# EAGLE schematic BEP33_6panel_DESKTOP-T8KKGMJ_Mai-19-014544-2018_Conflict (EAGLE 7.7.0), part 1 of 2

## Sheet 1 of 7
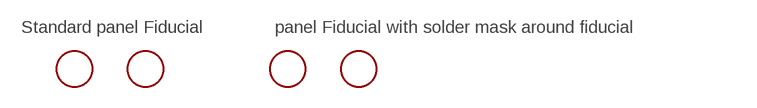
[diagram p0: schematic, sheet 1]

### Parts
FID1  FIDUCIAL  [FIDUCIAL_1MM]
FID1B  FIDUCIALFIDUCIAL_1MM_WITH_SOLDERMASK  [FIDUCIAL_1MM_WITH_SOLDERMASK]
FID2  FIDUCIAL  [FIDUCIAL_1MM]
FID2B  FIDUCIALFIDUCIAL_1MM_WITH_SOLDERMASK  [FIDUCIAL_1MM_WITH_SOLDERMASK]

### Notes on the sheet
- Standard panel Fiducial | panel Fiducial with solder mask around fiducial

## Sheet 2 of 7
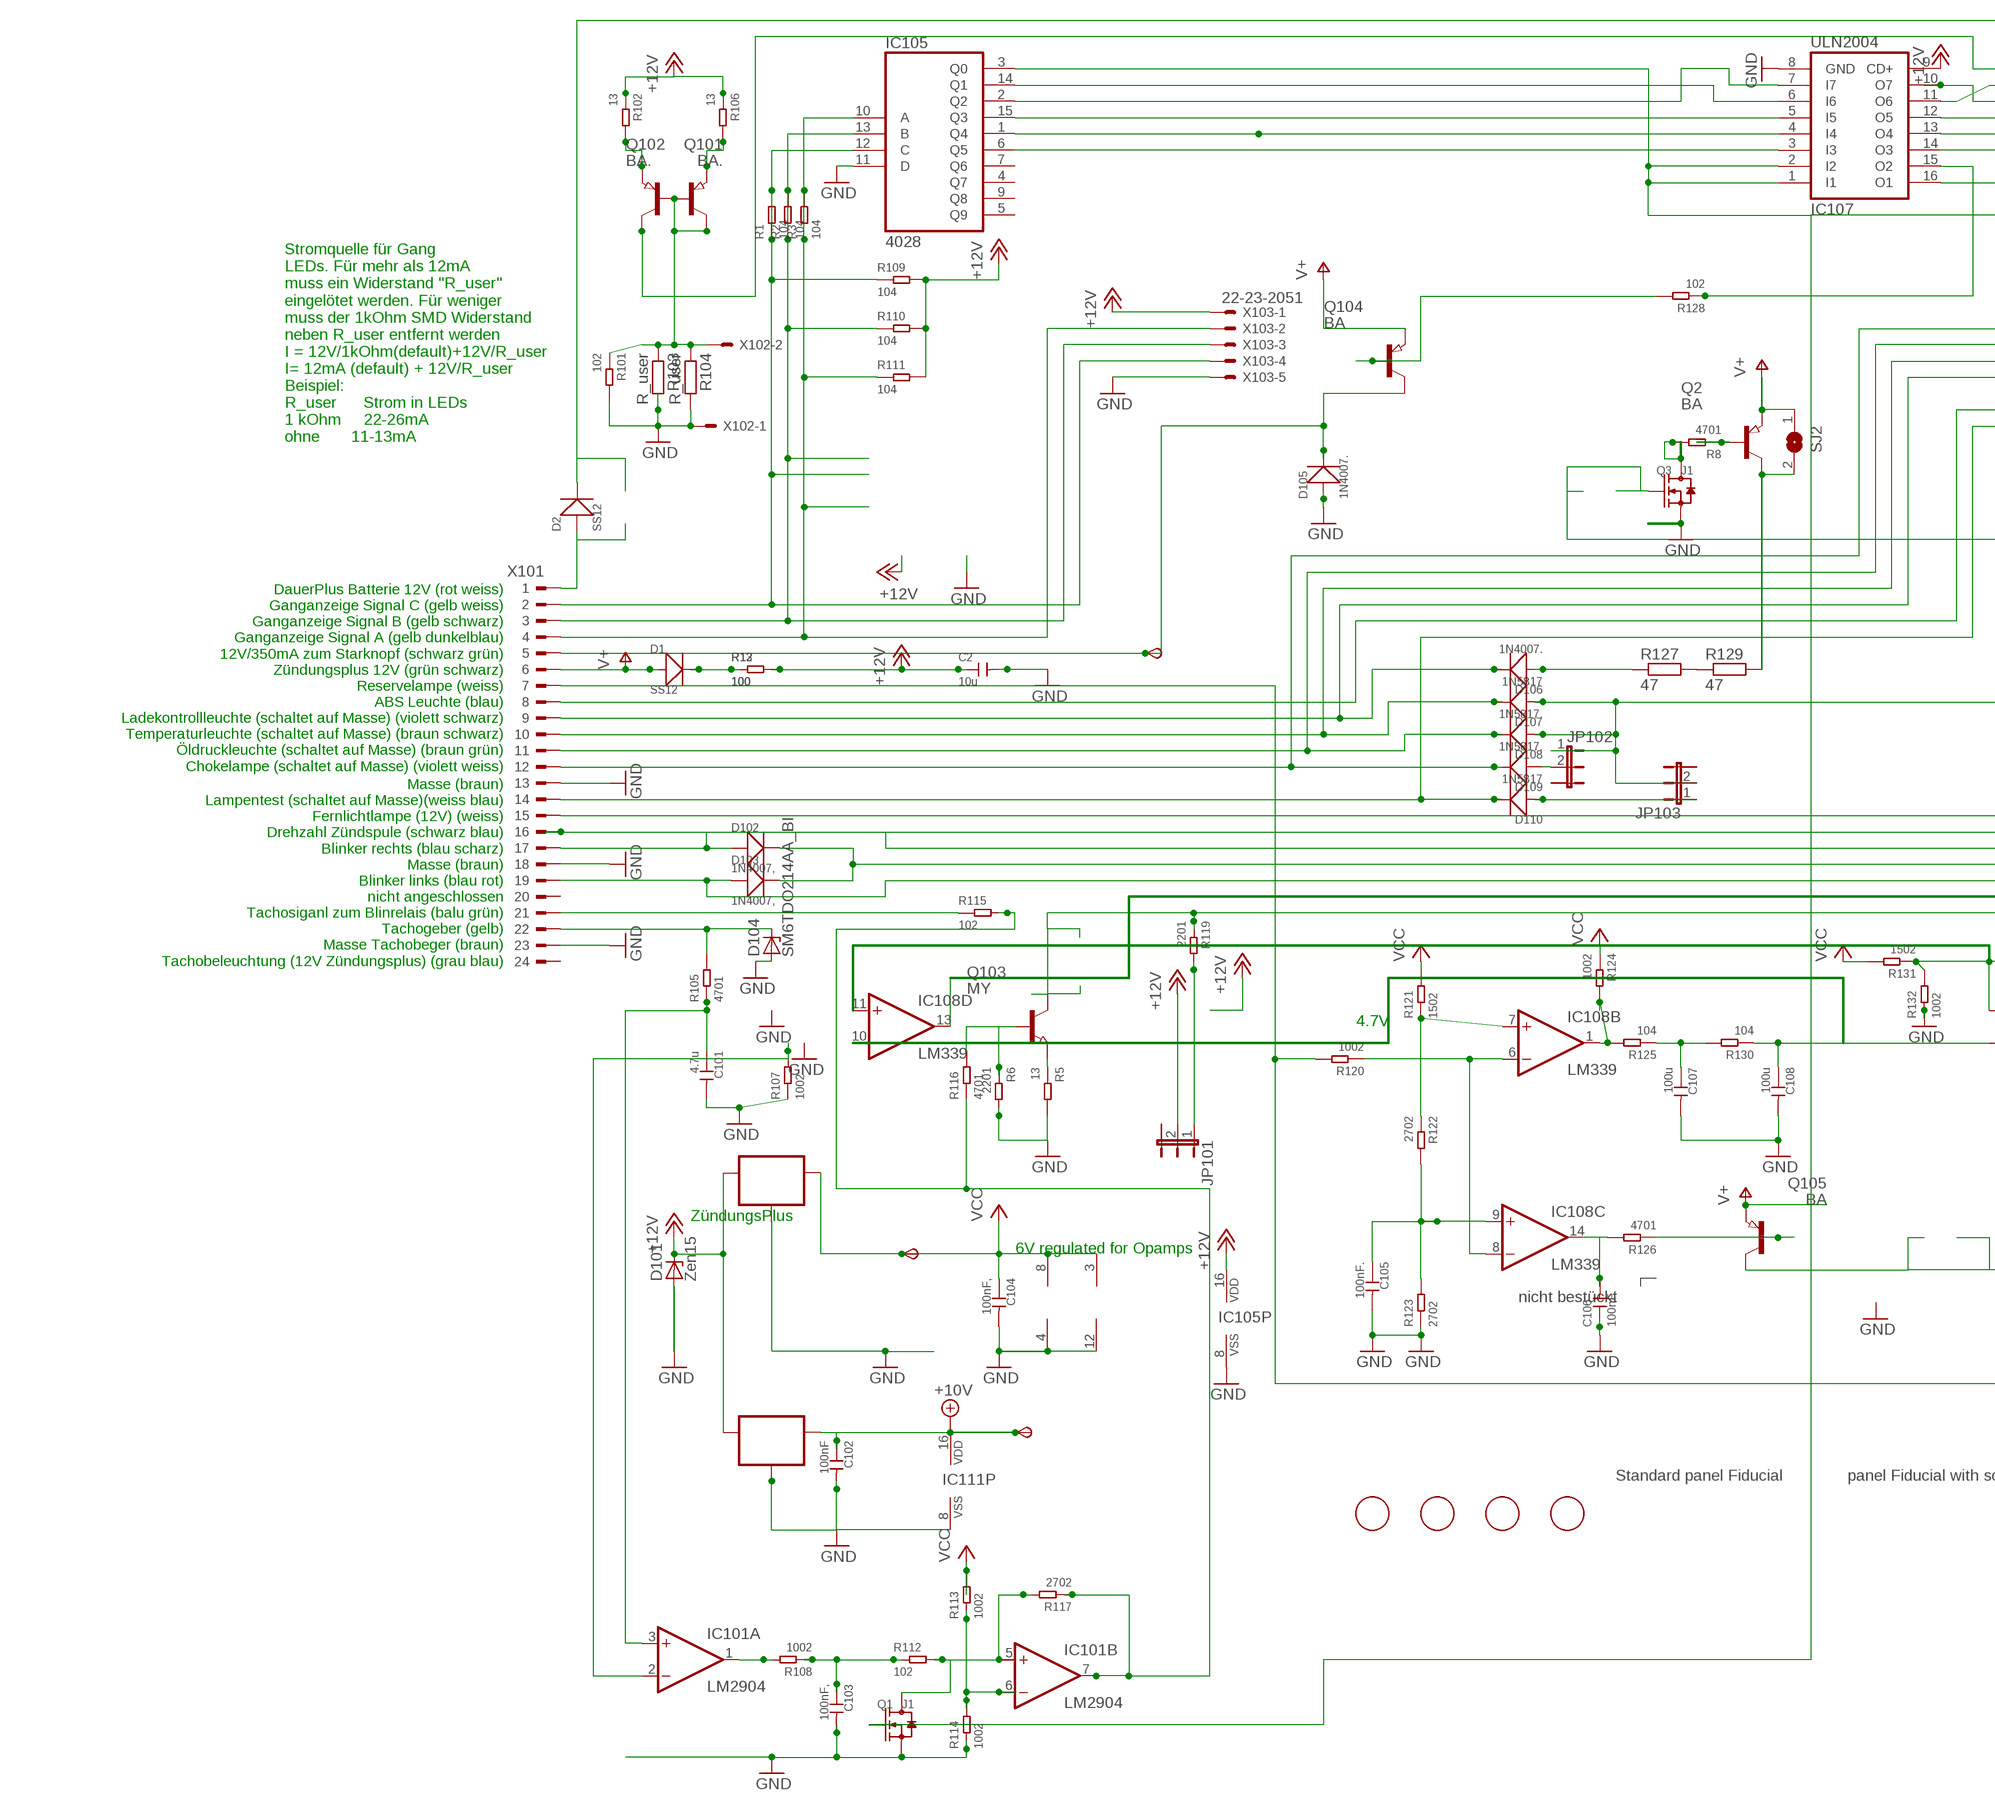
[diagram p1: schematic, sheet 2, part 1 of 2]
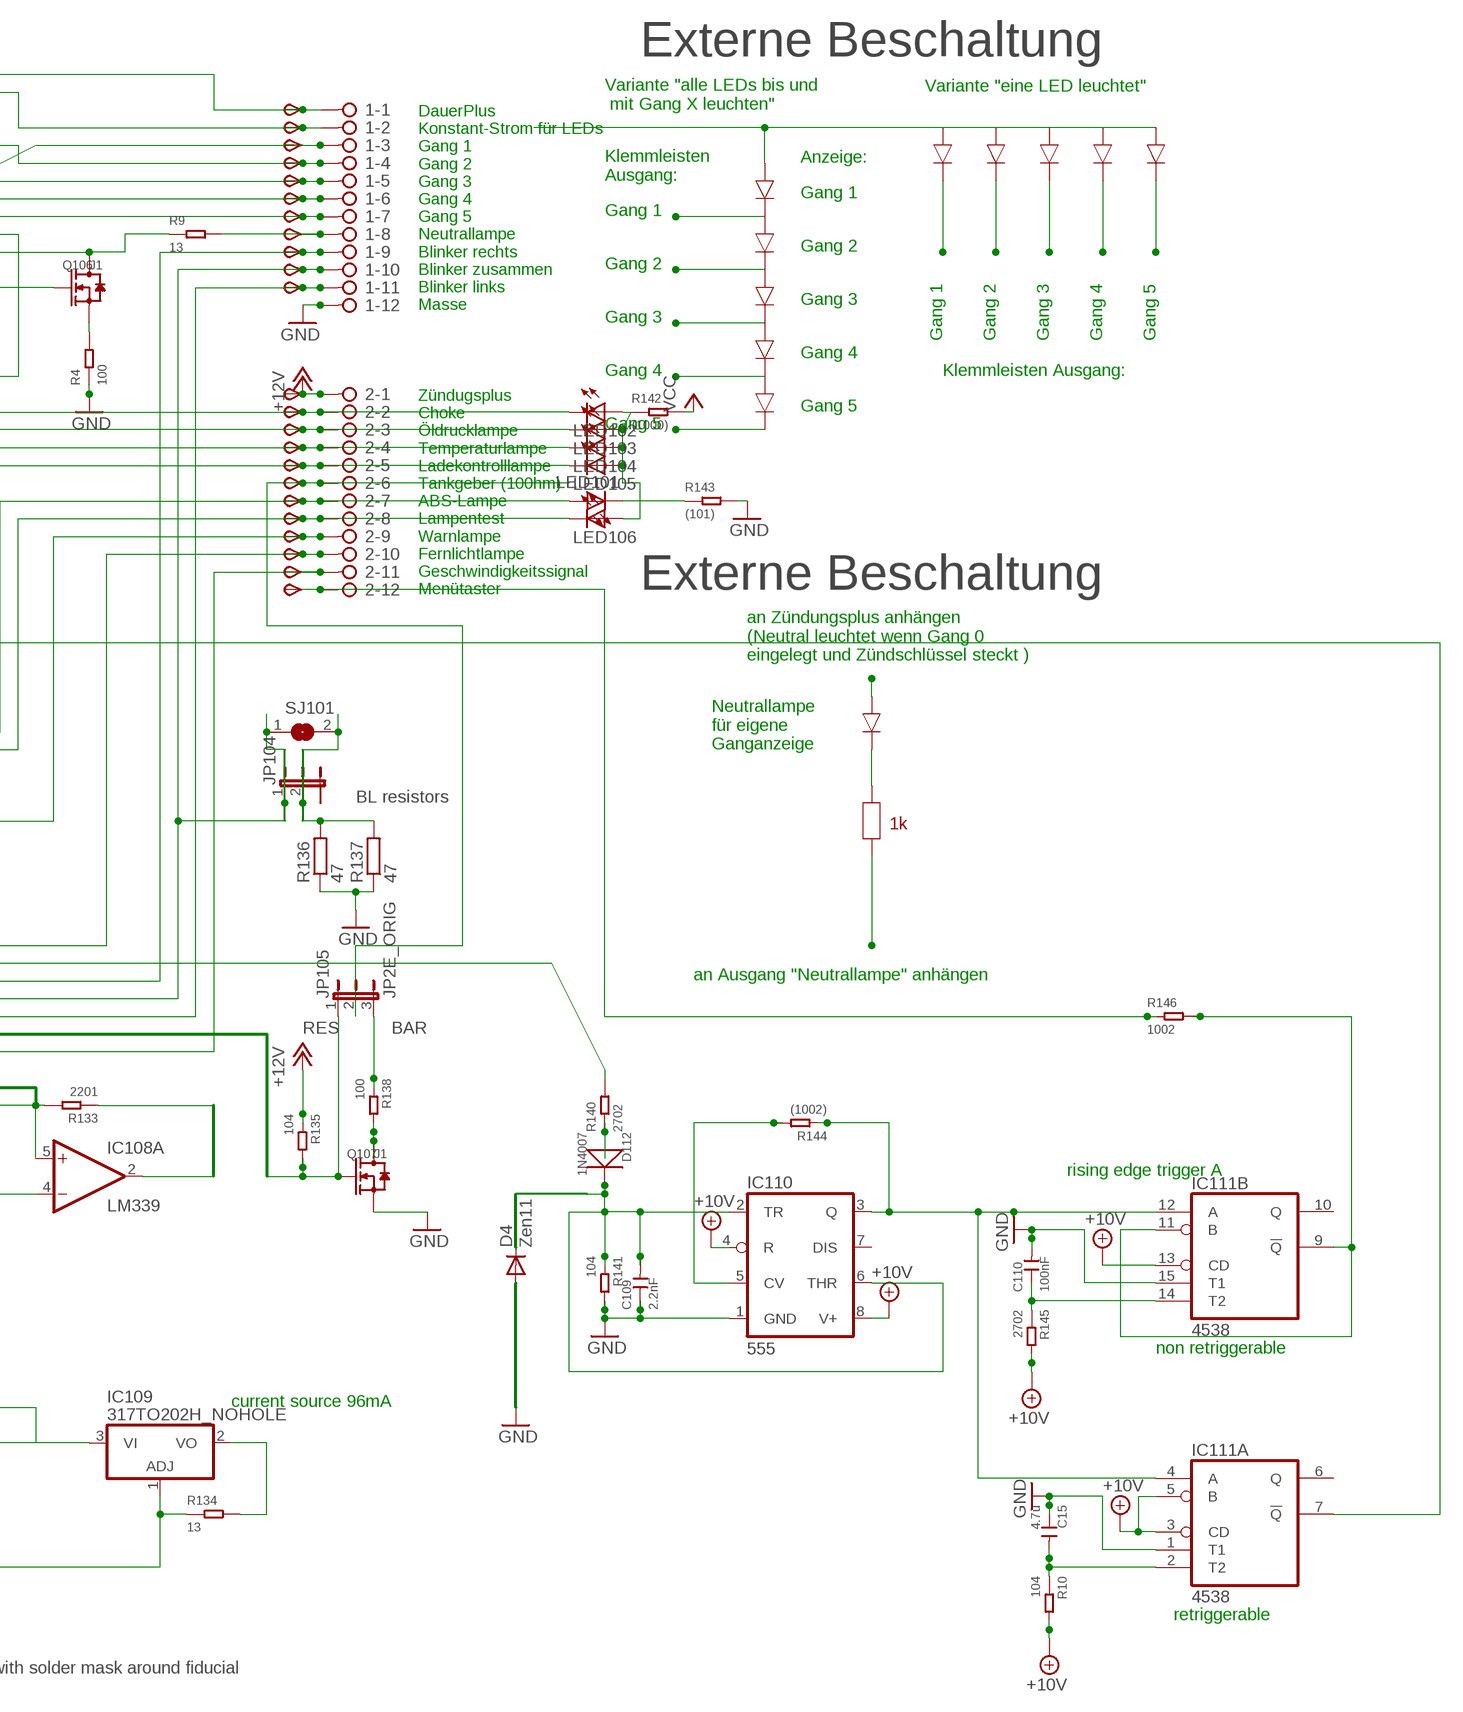
[diagram p2: schematic, sheet 2, part 2 of 2]

### Parts
1  2081-1132  [12-PIN]
2  2081-1132  [12-PIN]
6V  TPSB2.0  [B2.0]
10V  TPSB2.0  [B2.0]
C2  10u  CERAMIC-100UF-6.3V-20%-X5R(1206)  [C1206]
C15  4.7u  CERAMIC-4.7UF-25V-10%-X5R(0805)  [C0805]
C101  4.7u  CERAMIC-4.7UF-25V-10%-X5R(0805)  [C0805]
C102  100nF  CERAMIC-100NF-50V-10%-X7R(0805)  [C0805]
C103  100nF,  CERAMIC-100NF-50V-10%-X7R(0805)  [C0805]
C104  100nF,  CERAMIC-100NF-50V-10%-X7R(0805)  [C0805]
C105  100nF.  CERAMIC-100NF-50V-10%-X7R(0805)  [C0805]
C106  100nF.  CERAMIC-100NF-50V-10%-X7R(0805)  [C0805]
C107  100u  CERAMIC-100UF-6.3V-20%-X5R(1206)  [C1206]
C108  100u  CERAMIC-100UF-6.3V-20%-X5R(1206)  [C1206]
C109  2.2nF  CERAMIC-100NF-50V-10%-X7R(0805)  [C0805]
C110  100nF  CERAMIC-100NF-50V-10%-X7R(0805)  [C0805]
D1  SS12  DIODE-GEN-PURPOSE-1KV-1A(DO-214AC)DO-214AC/1206  [DO-214AC_SLIM]
D2  SS12  DIODE-GEN-PURPOSE-1KV-1A(DO-214AC)DO-214AC/1206  [DO-214AC_SLIM]
D4  Zen11  CGRM4001-G  [SOD-123_MINI-SMA]
D101  Zen15  SM6T  [DO214AA]
D102  1N4007,  DIODE-GEN-PURPOSE-1KV-1A(DO-214AC)  [DO-214AC]
D103  1N4007,  DIODE-GEN-PURPOSE-1KV-1A(DO-214AC)  [DO-214AC]
D104  SM6TDO214AA_BI  [DO214AA_BI]
D105  1N4007.  DIODE-GEN-PURPOSE-1KV-1A(DO-214AC)  [DO-214AC]
D106  1N4007.  DIODE-GEN-PURPOSE-1KV-1A(DO-214AC)  [DO-214AC]
D107  1N5817  DIODE-GEN-PURPOSE-1KV-1A(DO-214AC)DO-214AC/1206  [DO-214AC_SLIM]
D108  1N5817.  DIODE-GEN-PURPOSE-1KV-1A(DO-214AC)DO-214AC/1206  [DO-214AC_SLIM]
D109  1N5817.  DIODE-GEN-PURPOSE-1KV-1A(DO-214AC)DO-214AC/1206  [DO-214AC_SLIM]
D110  1N5817  DIODE-GEN-PURPOSE-1KV-1A(DO-214AC)DO-214AC/1206  [DO-214AC_SLIM]
D112  1N4007  DIODE-GEN-PURPOSE-1KV-1A(DO-214AC)  [DO-214AC]
FID101  FIDUCIAL  [FIDUCIAL_1MM]
FID102  FIDUCIAL  [FIDUCIAL_1MM]
FID103  FIDUCIAL  [FIDUCIAL_1MM]
FID104  FIDUCIAL  [FIDUCIAL_1MM]
IC101  LM2904  LM358D  [SO08]
IC102  78L06  78LXXSOT89_ROUND  [SOT89_ROUND]
IC104  78L10  78LXXSOT89_ROUND  [SOT89_ROUND]
IC105  4028  4028D  [SO16]
IC107  ULN2004  ULN2004AD  [SO16]
IC108  LM339  LM339D  [SO14]
IC109  317TO202H_NOHOLE  [TO220H_NOHOLE]
IC110  555  NE555D  [SO08]
IC111  4538  4538D  [SO16]
JP101  JP2EJP2_SMALLPADS  [JP2_SMALLPADS]
JP102  JP2EJP2_SMALLPADS  [JP2_SMALLPADS]
JP103  JP2EJP2_SMALLPADS  [JP2_SMALLPADS]
JP104  JP2EJP2_SMALLPADS  [JP2_SMALLPADS]
JP105  JP2E_ORIG  [JP2_ORIG_SMALLPADS]
LED101  LEDLD260  [LD260]
LED102  LEDLD260  [LD260]
LED103  LEDLD260  [LD260]
LED104  LEDLD260  [LD260]
LED105  LEDLD260  [LD260]
LED106  LEDLD260  [LD260]
Q1  J1  SMD-MOSFET-N-CH-50V-200MA-BSS138W-7-F(SOT-23)  [SOT-23]
Q2  BA  PNP-TRANSISTOR_SOT89  [SOT89]
Q3  J1  SMD-MOSFET-N-CH-50V-200MA-BSS138W-7-F(SOT-23)  [SOT-23]
Q101  BA.  PNP-TRANSISTOR_SOT89  [SOT89]
Q102  BA.  PNP-TRANSISTOR_SOT89  [SOT89]
Q103  MY  NPN-TRANSISTOR_SOT89  [SOT89]
Q104  BA  PNP-TRANSISTOR_SOT89  [SOT89]
Q105  BA  PNP-TRANSISTOR_SOT89  [SOT89]
Q106  J1  SMD-MOSFET-N-CH-50V-200MA-BSS138W-7-F(SOT-23)  [SOT-23]
Q107  J1  SMD-MOSFET-N-CH-50V-200MA-BSS138W-7-F(SOT-23)  [SOT-23]
R1  104  SMD-RES-10K-1%-1/8W(0805)  [R0805]
R2  104  SMD-RES-10K-1%-1/8W(0805)  [R0805]
R3  104  SMD-RES-10K-1%-1/8W(0805)  [R0805]
R4  100  SMD-RES-220R-5%-1/8W(0805)  [R0805]
R5  13  SMD-RES-13R-5%-1/4W(1206)  [R1206]
R6  2201  SMD-RES-1K-5%-1/8W(0805)  [R0805]
R8  4701  SMD-RES-4.7K-5%-1/8W(0805)  [R0805]
R9  13  SMD-RES-13R-5%-1/4W(1206)  [R1206]
R10  104  SMD-RES-4.7K-5%-1/8W(0805)  [R0805]
R12  100  SMD-RES-2.2K-5%-1/8W(0805)  [R0805]
R13  100  SMD-RES-2.2K-5%-1/8W(0805)  [R0805]
R101  102  SMD-RES-1K-5%-1/8W(0805)  [R0805]
R102  13  SMD-RES-13R-5%-1/4W(1206)  [R1206]
R103  R_user  R-EU_R0805  [R0805]
R104  R_user  R-EU_R0805  [R0805]
R105  4701  SMD-RES-4.7K-5%-1/8W(0805)  [R0805]
R106  13  SMD-RES-13R-5%-1/4W(1206)  [R1206]
R107  1002  SMD-RES-10K-1%-1/8W(0805)  [R0805]
R108  1002  SMD-RES-10K-1%-1/8W(0805)  [R0805]
R109  104  SMD-RES-10K-1%-1/8W(0805)  [R0805]
R110  104  SMD-RES-10K-1%-1/8W(0805)  [R0805]
R111  104  SMD-RES-10K-1%-1/8W(0805)  [R0805]
R112  102  SMD-RES-1K-5%-1/8W(0805)  [R0805]
R113  1002  SMD-RES-1K-5%-1/8W(0805)  [R0805]
R114  1002  SMD-RES-1K-5%-1/8W(0805)  [R0805]
R115  102  SMD-RES-220R-5%-1/8W(0805)  [R0805]
R116  4701  SMD-RES-4.7K-5%-1/8W(0805)  [R0805]
R117  2702  SMD-RES-4.7K-5%-1/8W(0805)  [R0805]
R119  2201  SMD-RES-2.2K-5%-1/8W(0805)  [R0805]
R120  1002  SMD-RES-10K-1%-1/8W(0805)  [R0805]
R121  1502  SMD-RES-10K-1%-1/8W(0805)  [R0805]
R122  2702  SMD-RES-4.7K-5%-1/8W(0805)  [R0805]
R123  2702  SMD-RES-4.7K-5%-1/8W(0805)  [R0805]
R124  1002  SMD-RES-10K-1%-1/8W(0805)  [R0805]
R125  104  SMD-RES-10K-1%-1/8W(0805)  [R0805]
R126  4701  SMD-RES-4.7K-5%-1/8W(0805)  [R0805]
R127  47  R-EU_V235/17_1MM  [V235/17_1MM]
R128  102  SMD-RES-1K-5%-1/8W(0805)  [R0805]
R129  47  R-EU_V235/17_1MM  [V235/17_1MM]
R130  104  SMD-RES-10K-1%-1/8W(0805)  [R0805]
R131  1502  SMD-RES-10K-1%-1/8W(0805)  [R0805]
R132  1002  SMD-RES-10K-1%-1/8W(0805)  [R0805]
R133  2201  SMD-RES-2.2K-5%-1/8W(0805)  [R0805]
R134  13  SMD-RES-13R-5%-1/4W(1206)  [R1206]
R135  104  SMD-RES-10K-1%-1/8W(0805)  [R0805]
R136  47  R-EU_V235/17_1MM  [V235/17_1MM]
R137  47  R-EU_V235/17_1MM  [V235/17_1MM]
R138  100  SMD-RES-2.2K-5%-1/8W(0805)  [R0805]
R140  2702  SMD-RES-10K-1%-1/8W(0805)  [R0805]
R141  104  SMD-RES-10K-1%-1/8W(0805)  [R0805]
R142  (1000)  SMD-RES-100R-5%-1/8W(0805)  [R0805]
R143  (101)  SMD-RES-100R-5%-1/8W(0805)  [R0805]
R144  (1002)  SMD-RES-10K-1%-1/8W(0805)  [R0805]
R145  2702  SMD-RES-4.7K-5%-1/8W(0805)  [R0805]
R146  1002  SMD-RES-4.7K-5%-1/8W(0805)  [R0805]
SJ2  SJ  [SJ]
SJ101  SJ  [SJ]
START  TPSB2.0  [B2.0]
TP1  TPSB2.0  [B2.0]
TP2  TPSB2.0  [B2.0]
TP3  TPSB2.0  [B2.0]
TP4  TPSB2.0  [B2.0]
TP5  TPSB2.0  [B2.0]
TP6  TPSB2.0  [B2.0]
TP7  TPSB2.0  [B2.0]
TP8  TPSB2.0  [B2.0]
TP9  TPSB2.0  [B2.0]
TP10  TPSB2.0  [B2.0]
TP11  TPSB2.0  [B2.0]
TP12  TPSB2.0  [B2.0]
TP13  TPSB2.0  [B2.0]
TP16  TPSB2.0  [B2.0]
TP17  TPSB2.0  [B2.0]
TP18  TPSB2.0  [B2.0]
TP19  TPSB2.0  [B2.0]
TP21  TPSB2.0  [B2.0]
TP22  TPSB2.0  [B2.0]
TP23  TPSB2.0  [B2.0]
TP24  TPSB1,27  [B1,27]
TP25  TPSB2.0  [B2.0]
TP26  TPSB2.0  [B2.0]
X101  CON_BMWV2  [24-PIN_V2]
X102  22-23-2021  [22-23-2021]
X103  22-23-2051  [22-23-2051]

### Nets
+10V: 10V.TP(PP) C102.1 IC104.1(OUT) IC110.4(R) IC110.8(V+) IC111.3(A:CD) IC111.5(A:B) IC111.13(B:CD) IC111.16(P:VDD) R10.2 R145.2 ; also sheet 3,4,5,6,7
+12V: 2.1 C2.1 D101.C IC102.3(IN) IC104.3(IN) IC105.16(VDD) IC107.9(CD+) JP101.2 R12.2 R13.2 R102.1 R106.1 R109.2 R110.2 R111.2 R135.1 TP12.TP(PP) X103.1 ; also sheet 3,4,5,6,7
+12V1: 2.11 Q103.2(C) R119.1 TP26.TP(PP)
GND: 1.12 C2.2 C15.1 C101.2 C102.2 C103.2 C104.2 C105.2 C106.1 C107.2 C108.2 C109.1 C110.2 D4.A D101.A D104.A D105.1(+) IC101.4(P:V-) IC102.2(GND) IC102.2@1(GND) IC104.2(GND) IC104.2@1(GND) IC105.8(VSS) IC105.11(D) IC107.8(GND) IC108.12(P:GND) IC110.1(GND) IC111.1(A:T1) IC111.8(P:VSS) IC111.15(B:T1) Q1.2(S) Q3.2(S) Q107.2(S) R4.1 R5.2 R6.2 R101.2 R103.2 R104.2 R107.1 R114.1 R123.1 R132.1 R136.1 R137.1 R141.2 R143.2 X101.13 X101.18 X101.23 X102.1 X103.5 ; also sheet 3,4,5,6,7
N$1: 2.9 D107.1(+) D108.1(+) JP102.1 JP103.2 TP24.TP(PP)
N$2: IC105.10(A) R3.1 R3.2 R111.1 X101.4 X103.2
N$3: IC105.13(B) R2.1 R2.2 R110.1 X101.3 X103.3
N$4: 2.7 LED101.A TP22.TP(PP) X101.8
N$5: Q101.3(E) R102.2
N$6: Q2.1(B) R8.1
N$7: IC101.2(A:-IN) R107.2
N$8: R127.2 R129.1
N$9: Q102.3(E) R106.2
N$11: D105.2(-) Q104.2(C) START.TP(PP) X101.5
N$12: 2.2 D109.2(-) LED102.K(C) TP16.TP(PP) X101.12
N$13: 2.3 D108.2(-) LED103.K(C) TP17.TP(PP) X101.11
N$14: 2.4 D107.2(-) LED104.K(C) TP18.TP(PP) X101.10
N$15: IC109.3(VI) Q105.2(C)
N$16: IC108.6(B:-IN) IC108.8(C:-IN) R120.1
N$17: IC105.12(C) R1.1 R1.2 R109.1 X101.2 X103.4
N$18: IC105.15(Q3) IC107.5(I5)
N$19: 2.8 D110.2(-) LED106.K(C) TP23.TP(PP) X101.14
N$20: 1.9 D102.1(+) TP9.TP(PP) X101.17
N$21: 1.11 D103.1(+) TP11.TP(PP) X101.19
N$22: IC111.9(B:!Q) IC111.11(B:B) R146.2
N$23: D104.C R105.2 X101.22
N$24: C101.1 IC101.3(A:+IN) R105.1
N$25: 1.6 IC107.13(O4) TP6.TP(PP)
N$26: 1.7 IC107.14(O3) TP7.TP(PP)
N$27: D1.2(-) R12.1 R13.1
N$28: 2.6 JP105.2 TP21.TP(PP)
N$29: JP101.1 R119.2
N$30: C105.1 IC108.9(C:+IN) R122.2 R123.2
N$31: C106.2 IC108.14(C:OUT) R126.2
N$32: Q3.3(D) R8.2
N$34: LED101.K(C) R143.1
N$35: IC109.1(ADJ) R120.2 R134.1 X101.7
N$36: Q105.1(B) R126.1
N$37: IC105.2(Q2) IC107.7(I7)
N$38: 1.3 IC107.11(O6) TP3.TP(PP)
N$39: 1.5 IC107.12(O5) TP5.TP(PP)
N$41: LED102.A LED103.A LED104.A LED105.A LED106.A R142.1
N$42: R140.2 X101.16
N$43: Q104.1(B) R128.2
N$44: IC105.3(Q0) IC107.1(I1) IC107.2(I2) Q1.1(G) Q106.1(G)
N$45: C107.1 R125.1 R130.2
N$46: C108.1 IC108.4(A:-IN) IC108.10(D:-IN) R130.1
N$47: IC108.5(A:+IN) IC108.11(D:+IN) R131.1 R132.2 R133.2
N$48: Q107.3(D) R138.2
N$49: IC111.7(A:!Q) Q3.1(G)
N$50: IC105.1(Q4) IC107.4(I4)
N$51: R115.1 X101.21
N$52: IC107.16(O1) Q106.3(D) R9.1
N$53: 2.10 TP25.TP(PP) X101.15
N$54: D106.1(+) R127.1
N$55: 2.5 D106.2(-) LED105.K(C) TP19.TP(PP) X101.9
N$56: IC105.14(Q1) IC107.6(I6)
N$57: Q101.1(B) Q102.1(B) Q102.2(C) R101.1 R103.1 R104.1 X102.2
N$58: 1.8 R9.2 TP8.TP(PP)
N$59: 1.2 Q101.2(C) TP2.TP(PP)
N$60: IC108.13(D:OUT) JP105.1 Q107.1(G) R135.2
N$61: IC105.6(Q5) IC107.3(I3)
N$64: IC109.2(VO) R134.2
N$65: IC110.5(CV) R144.2
N$67: 1.4 IC107.10(O7) TP4.TP(PP)
N$69: 1.1 D2.2(-) TP1.TP(PP)
N$83: IC108.7(B:+IN) R121.1 R122.1
N$84: Q106.2(S) R4.2
N$85: Q103.1(B) R6.1 R116.2
N$86: IC110.3(Q) IC111.4(A:A) IC111.12(B:A) R144.1
N$87: D112.1(+) R140.1
N$88: IC107.15(O2) R128.1
N$89: C110.1 IC111.14(B:T2) R145.1
N$90: 2.12 R146.1 TP13.TP(PP)
N$91: D2.1(+) X101.1
N$92: IC101.1(A:OUT) R108.2
N$93: 1.10 D102.2(-) D103.2(-) JP104.1 SJ101.1 TP10.TP(PP)
N$94: JP104.2 R136.2 R137.2 SJ101.2
N$95: D109.1(+) JP102.2
N$96: C103.1 R108.1 R112.1
N$97: IC101.5(B:+IN) Q1.3(D) R112.2 R117.2
N$98: D110.1(+) JP103.1
N$99: JP105.3 R138.1
N$100: Q103.3(E) R5.1
N$101: IC101.6(B:-IN) R113.1 R114.2
N$102: C109.2 D4.C D112.2(-) IC110.2(TR) IC110.6(THR) R141.1
N$103: C15.2 IC111.2(A:T2) R10.1
N$104: Q2.2(C) R129.2 SJ2.2
N$107: IC101.7(B:OUT) R115.2 R116.1 R117.1
N$108: IC108.2(A:OUT) R133.1
N$580: IC108.1(B:OUT) R124.2 R125.2
V+: D1.1(+) Q2.3(E) Q104.3(E) Q105.3(E) SJ2.1 X101.6 ; also sheet 3,4,5,6,7
VCC: 6V.TP(PP) C104.1 IC101.8(P:V+) IC102.1(OUT) IC108.3(P:V+) R113.2 R121.2 R124.1 R131.2 R142.2 ; also sheet 3,4,5,6,7
Unconnected: IC105.4(Q7) IC105.5(Q9) IC105.7(Q6) IC105.9(Q8) IC110.7(DIS) IC111.6(A:Q) IC111.10(B:Q) X101.20 X101.24

### Notes on the sheet
- Externe Beschaltung
- Variante "eine LED leuchtet"
- Variante "alle LEDs bis und
   mit Gang X leuchten"
- Anzeige:
- Klemmleisten
  Ausgang:
- Gang 1
- DauerPlus
  Konstant-Strom für LEDs
  Gang 1
  Gang 2
  Gang 3
  Gang 4
  Gang 5
  Neutrallampe
  Blinker rechts
  Blinker zusammen
  Blinker links
  Masse
- Gang 1
- Gang 2
- Gang 2
- Gang 3
- Gang 3
- Gang 1 | Gang 2 | Gang 3 | Gang 4 | Gang 5
- Gang 4
- Gang 4 | Klemmleisten Ausgang:
- Gang 5
- Gang 5
- Zündugsplus
  Choke
  Öldrucklampe
  Temperaturlampe
  Ladekontrolllampe
  Tankgeber (100hm)
  ABS-Lampe
  Lampentest
  Warnlampe
  Fernlichtlampe
  Geschwindigkeitssignal
  Menütaster
- Stromquelle für Gang
  LEDs. Für mehr als 12mA
  muss ein Widerstand "R_user"
  eingelötet werden. Für weniger
  muss der 1kOhm SMD Widerstand
  neben R_user entfernt werden
  I = 12V/1kOhm(default)+12V/R_user
  I= 12mA (default) + 12V/R_user
  Beispiel:
  R_user      Strom in LEDs
  1 kOhm     22-26mA
  ohne       11-13mA
- Externe Beschaltung
- an Zündungsplus anhängen
  (Neutral leuchtet wenn Gang 0
  eingelegt und Zündschlüssel steckt )
- Neutrallampe
  für eigene
  Ganganzeige
- DauerPlus Batterie 12V (rot weiss)
  Ganganzeige Signal C (gelb weiss)
  Ganganzeige Signal B (gelb schwarz)
  Ganganzeige Signal A (gelb dunkelblau)
  12V/350mA zum Starknopf (schwarz grün)
  Zündungsplus 12V (grün schwarz)
  Reservelampe (weiss)
  ABS Leuchte (blau)
  Ladekontrollleuchte (schaltet auf Masse) (violett schwarz)
  Temperaturleuchte (schaltet auf Masse) (braun schwarz)
  Öldruckleuchte (schaltet auf Masse) (braun grün)
  Chokelampe (schaltet auf Masse) (violett weiss)
- BL resistors
- 1k
- an Ausgang "Neutrallampe" anhängen
- Masse (braun)
  Lampentest (schaltet auf Masse)(weiss blau)
  Fernlichtlampe (12V) (weiss)
  Drehzahl Zündspule (schwarz blau)
  Blinker rechts (blau scharz)
  Masse (braun)
  Blinker links (blau rot)
  nicht angeschlossen
  Tachosiganl zum Blinrelais (balu grün)
  Tachogeber (gelb)
  Masse Tachobeger (braun)
  Tachobeleuchtung (12V Zündungsplus) (grau blau)
- RES | BAR
- 4.7V | rising edge trigger A
- non retriggerable
- ZündungsPlus
- current source 96mA
- 6V regulated for Opamps
- nicht bestückt
- retriggerable
- Standard panel Fiducial | panel Fiducial with solder mask around fiducial

## Sheet 3 of 7
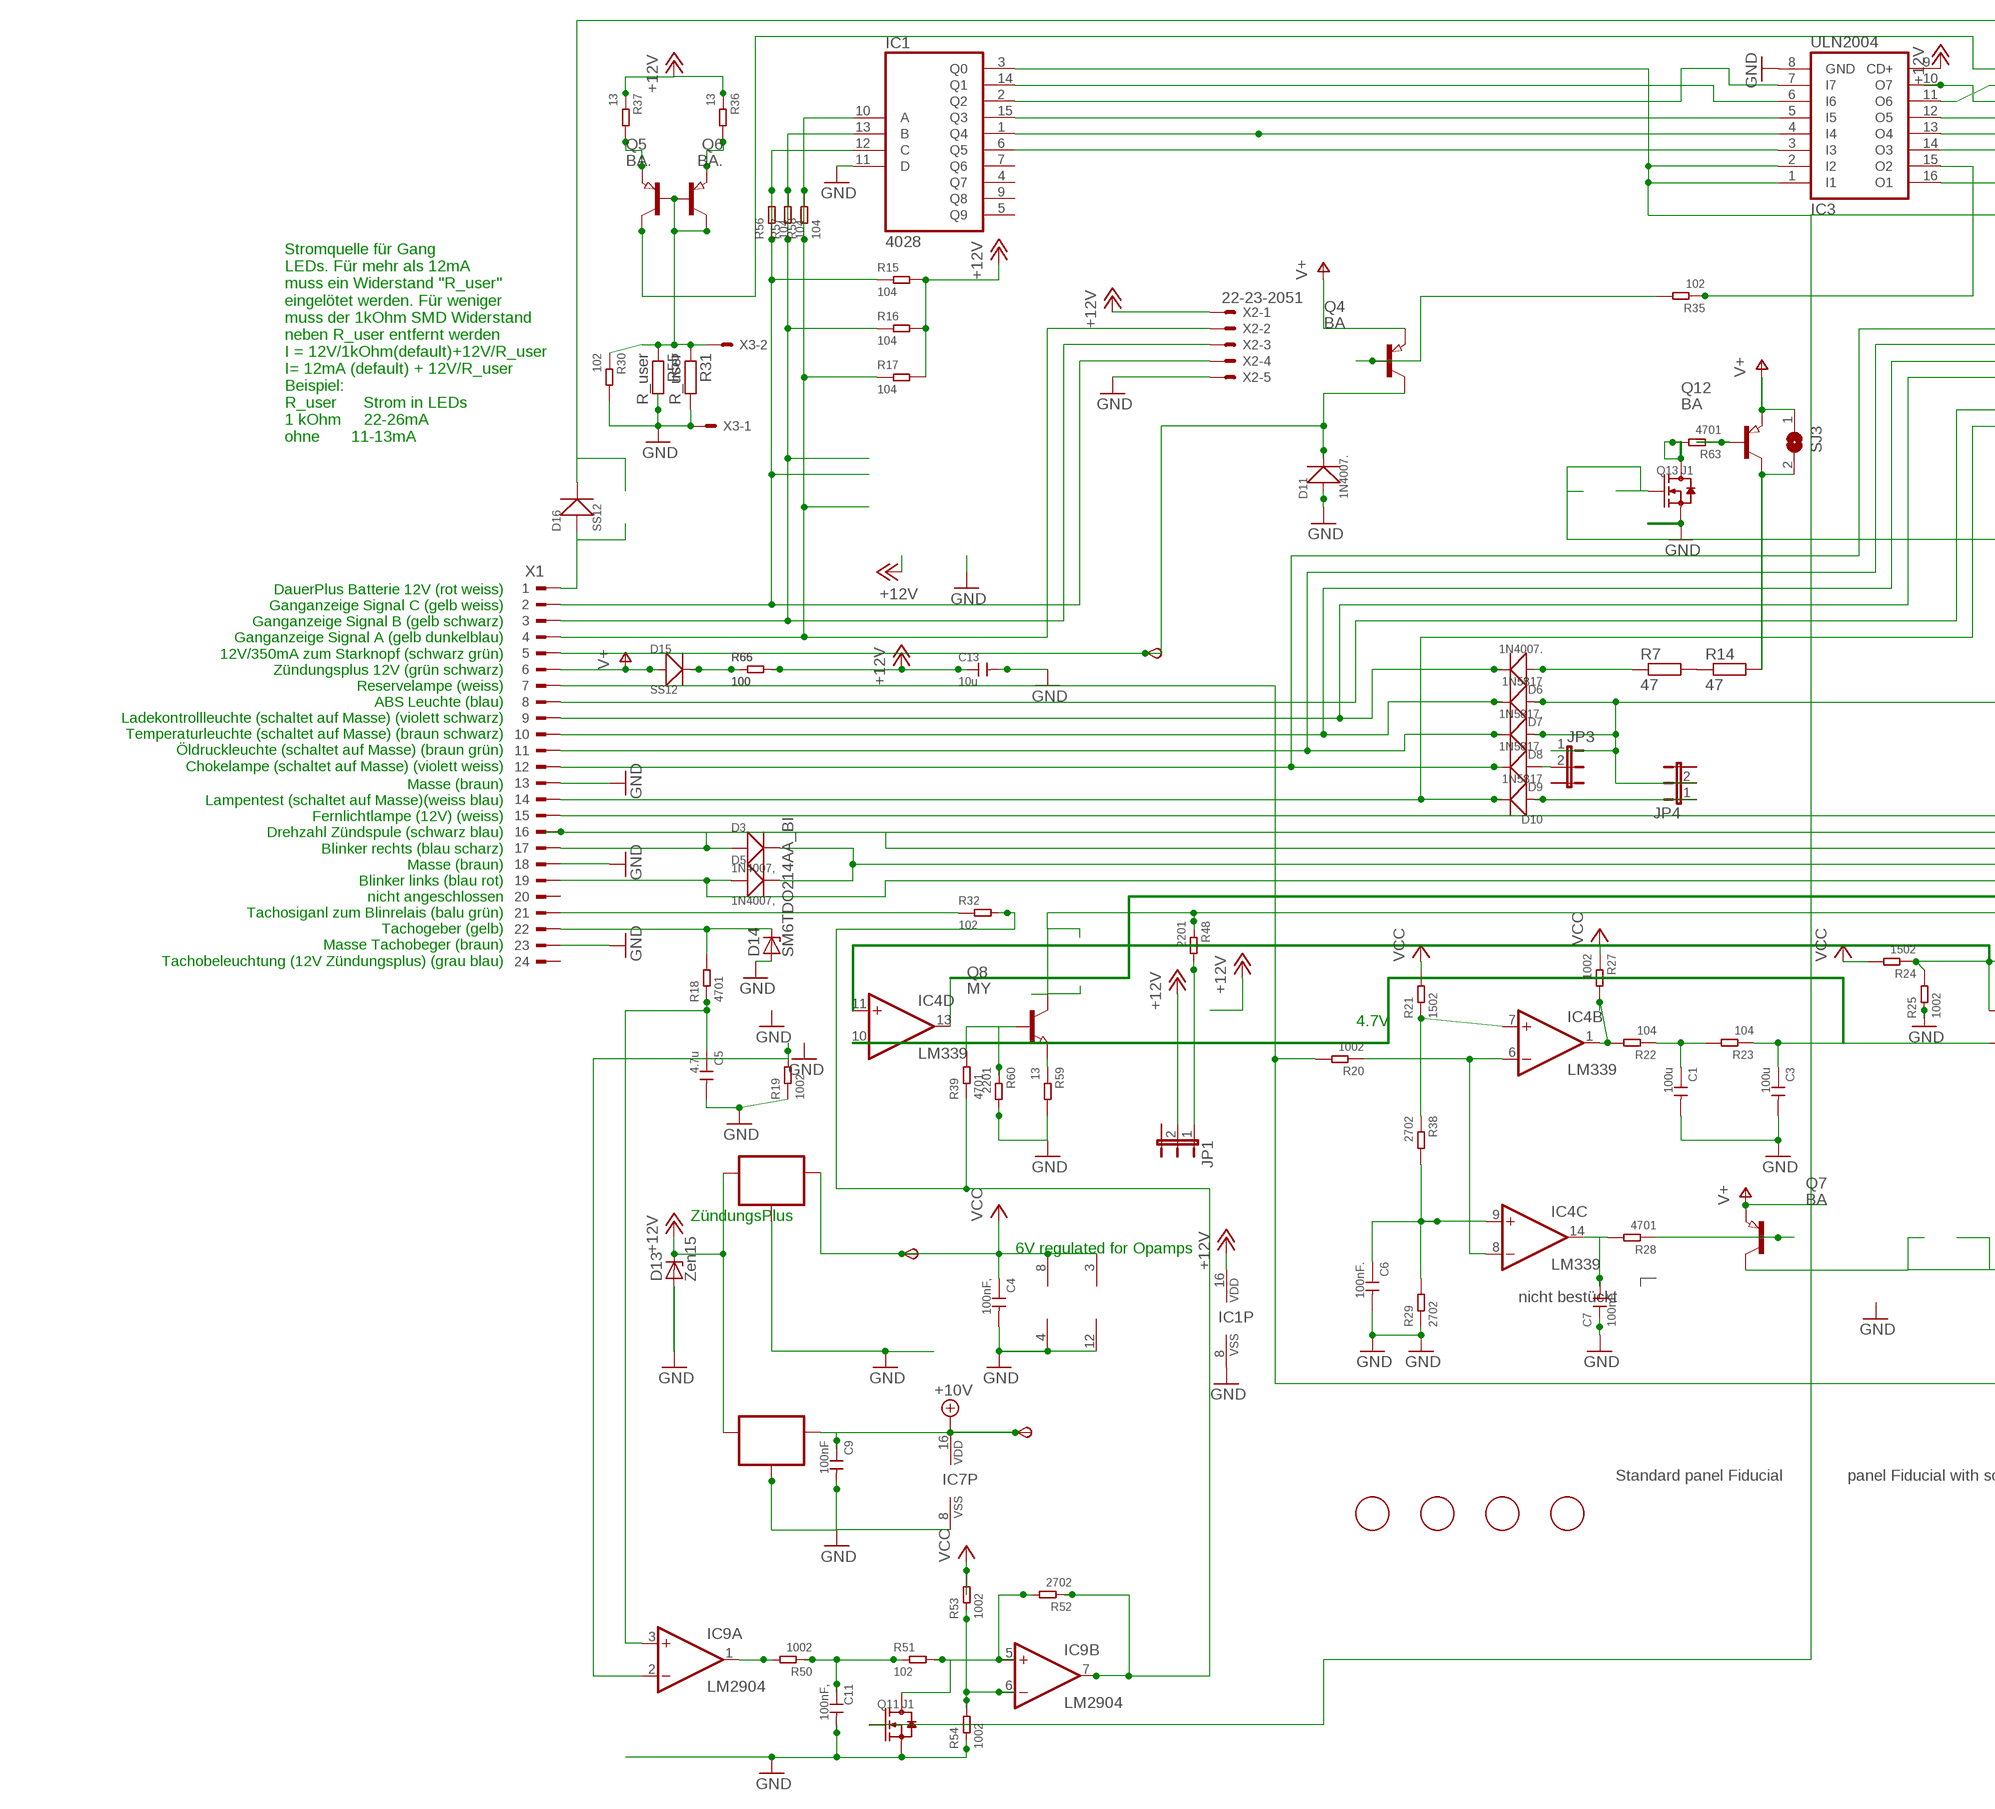
[diagram p3: schematic, sheet 3, part 1 of 2]
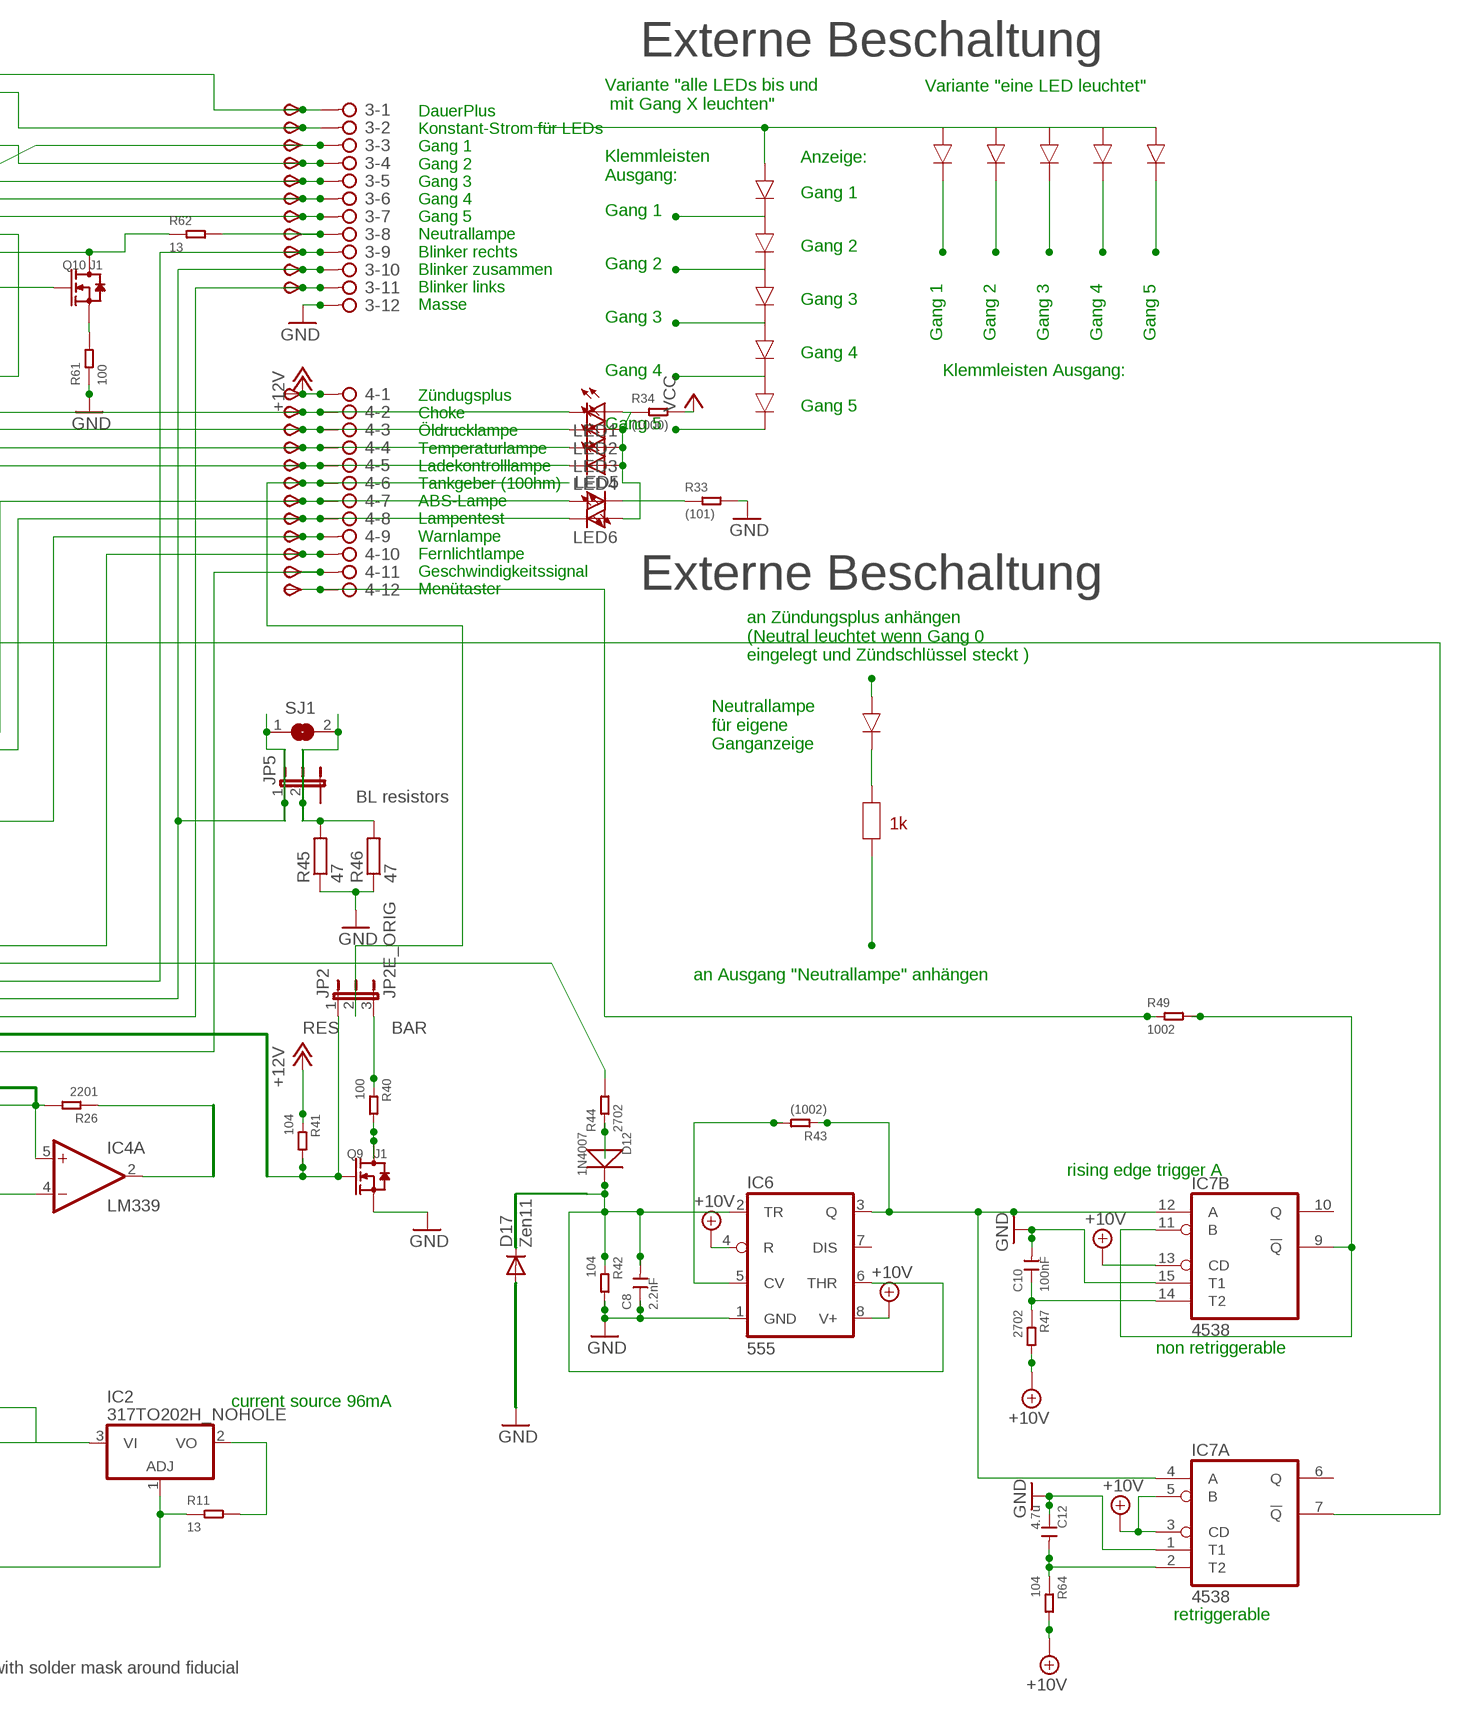
[diagram p4: schematic, sheet 3, part 2 of 2]

### Parts
3  2081-1132  [12-PIN]
4  2081-1132  [12-PIN]
6V1  TPSB2.0  [B2.0]
10V1  TPSB2.0  [B2.0]
C1  100u  CERAMIC-100UF-6.3V-20%-X5R(1206)  [C1206]
C3  100u  CERAMIC-100UF-6.3V-20%-X5R(1206)  [C1206]
C4  100nF,  CERAMIC-100NF-50V-10%-X7R(0805)  [C0805]
C5  4.7u  CERAMIC-4.7UF-25V-10%-X5R(0805)  [C0805]
C6  100nF.  CERAMIC-100NF-50V-10%-X7R(0805)  [C0805]
C7  100nF.  CERAMIC-100NF-50V-10%-X7R(0805)  [C0805]
C8  2.2nF  CERAMIC-100NF-50V-10%-X7R(0805)  [C0805]
C9  100nF  CERAMIC-100NF-50V-10%-X7R(0805)  [C0805]
C10  100nF  CERAMIC-100NF-50V-10%-X7R(0805)  [C0805]
C11  100nF,  CERAMIC-100NF-50V-10%-X7R(0805)  [C0805]
C12  4.7u  CERAMIC-4.7UF-25V-10%-X5R(0805)  [C0805]
C13  10u  CERAMIC-100UF-6.3V-20%-X5R(1206)  [C1206]
D3  1N4007,  DIODE-GEN-PURPOSE-1KV-1A(DO-214AC)  [DO-214AC]
D5  1N4007,  DIODE-GEN-PURPOSE-1KV-1A(DO-214AC)  [DO-214AC]
D6  1N4007.  DIODE-GEN-PURPOSE-1KV-1A(DO-214AC)  [DO-214AC]
D7  1N5817  DIODE-GEN-PURPOSE-1KV-1A(DO-214AC)DO-214AC/1206  [DO-214AC_SLIM]
D8  1N5817.  DIODE-GEN-PURPOSE-1KV-1A(DO-214AC)DO-214AC/1206  [DO-214AC_SLIM]
D9  1N5817.  DIODE-GEN-PURPOSE-1KV-1A(DO-214AC)DO-214AC/1206  [DO-214AC_SLIM]
D10  1N5817  DIODE-GEN-PURPOSE-1KV-1A(DO-214AC)DO-214AC/1206  [DO-214AC_SLIM]
D11  1N4007.  DIODE-GEN-PURPOSE-1KV-1A(DO-214AC)  [DO-214AC]
D12  1N4007  DIODE-GEN-PURPOSE-1KV-1A(DO-214AC)  [DO-214AC]
D13  Zen15  SM6T  [DO214AA]
D14  SM6TDO214AA_BI  [DO214AA_BI]
D15  SS12  DIODE-GEN-PURPOSE-1KV-1A(DO-214AC)DO-214AC/1206  [DO-214AC_SLIM]
D16  SS12  DIODE-GEN-PURPOSE-1KV-1A(DO-214AC)DO-214AC/1206  [DO-214AC_SLIM]
D17  Zen11  CGRM4001-G  [SOD-123_MINI-SMA]
FID3  FIDUCIAL  [FIDUCIAL_1MM]
FID4  FIDUCIAL  [FIDUCIAL_1MM]
FID5  FIDUCIAL  [FIDUCIAL_1MM]
FID6  FIDUCIAL  [FIDUCIAL_1MM]
IC1  4028  4028D  [SO16]
IC2  317TO202H_NOHOLE  [TO220H_NOHOLE]
IC3  ULN2004  ULN2004AD  [SO16]
IC4  LM339  LM339D  [SO14]
IC5  78L06  78LXXSOT89_ROUND  [SOT89_ROUND]
IC6  555  NE555D  [SO08]
IC7  4538  4538D  [SO16]
IC8  78L10  78LXXSOT89_ROUND  [SOT89_ROUND]
IC9  LM2904  LM358D  [SO08]
JP1  JP2EJP2_SMALLPADS  [JP2_SMALLPADS]
JP2  JP2E_ORIG  [JP2_ORIG_SMALLPADS]
JP3  JP2EJP2_SMALLPADS  [JP2_SMALLPADS]
JP4  JP2EJP2_SMALLPADS  [JP2_SMALLPADS]
JP5  JP2EJP2_SMALLPADS  [JP2_SMALLPADS]
LED1  LEDLD260  [LD260]
LED2  LEDLD260  [LD260]
LED3  LEDLD260  [LD260]
LED4  LEDLD260  [LD260]
LED5  LEDLD260  [LD260]
LED6  LEDLD260  [LD260]
Q4  BA  PNP-TRANSISTOR_SOT89  [SOT89]
Q5  BA.  PNP-TRANSISTOR_SOT89  [SOT89]
Q6  BA.  PNP-TRANSISTOR_SOT89  [SOT89]
Q7  BA  PNP-TRANSISTOR_SOT89  [SOT89]
Q8  MY  NPN-TRANSISTOR_SOT89  [SOT89]
Q9  J1  SMD-MOSFET-N-CH-50V-200MA-BSS138W-7-F(SOT-23)  [SOT-23]
Q10  J1  SMD-MOSFET-N-CH-50V-200MA-BSS138W-7-F(SOT-23)  [SOT-23]
Q11  J1  SMD-MOSFET-N-CH-50V-200MA-BSS138W-7-F(SOT-23)  [SOT-23]
Q12  BA  PNP-TRANSISTOR_SOT89  [SOT89]
Q13  J1  SMD-MOSFET-N-CH-50V-200MA-BSS138W-7-F(SOT-23)  [SOT-23]
R7  47  R-EU_V235/17_1MM  [V235/17_1MM]
R11  13  SMD-RES-13R-5%-1/4W(1206)  [R1206]
R14  47  R-EU_V235/17_1MM  [V235/17_1MM]
R15  104  SMD-RES-10K-1%-1/8W(0805)  [R0805]
R16  104  SMD-RES-10K-1%-1/8W(0805)  [R0805]
R17  104  SMD-RES-10K-1%-1/8W(0805)  [R0805]
R18  4701  SMD-RES-4.7K-5%-1/8W(0805)  [R0805]
R19  1002  SMD-RES-10K-1%-1/8W(0805)  [R0805]
R20  1002  SMD-RES-10K-1%-1/8W(0805)  [R0805]
R21  1502  SMD-RES-10K-1%-1/8W(0805)  [R0805]
R22  104  SMD-RES-10K-1%-1/8W(0805)  [R0805]
R23  104  SMD-RES-10K-1%-1/8W(0805)  [R0805]
R24  1502  SMD-RES-10K-1%-1/8W(0805)  [R0805]
R25  1002  SMD-RES-10K-1%-1/8W(0805)  [R0805]
R26  2201  SMD-RES-2.2K-5%-1/8W(0805)  [R0805]
R27  1002  SMD-RES-10K-1%-1/8W(0805)  [R0805]
R28  4701  SMD-RES-4.7K-5%-1/8W(0805)  [R0805]
R29  2702  SMD-RES-4.7K-5%-1/8W(0805)  [R0805]
R30  102  SMD-RES-1K-5%-1/8W(0805)  [R0805]
R31  R_user  R-EU_R0805  [R0805]
R32  102  SMD-RES-220R-5%-1/8W(0805)  [R0805]
R33  (101)  SMD-RES-100R-5%-1/8W(0805)  [R0805]
R34  (1000)  SMD-RES-100R-5%-1/8W(0805)  [R0805]
R35  102  SMD-RES-1K-5%-1/8W(0805)  [R0805]
R36  13  SMD-RES-13R-5%-1/4W(1206)  [R1206]
R37  13  SMD-RES-13R-5%-1/4W(1206)  [R1206]
R38  2702  SMD-RES-4.7K-5%-1/8W(0805)  [R0805]
R39  4701  SMD-RES-4.7K-5%-1/8W(0805)  [R0805]
R40  100  SMD-RES-2.2K-5%-1/8W(0805)  [R0805]
R41  104  SMD-RES-10K-1%-1/8W(0805)  [R0805]
R42  104  SMD-RES-10K-1%-1/8W(0805)  [R0805]
R43  (1002)  SMD-RES-10K-1%-1/8W(0805)  [R0805]
R44  2702  SMD-RES-10K-1%-1/8W(0805)  [R0805]
R45  47  R-EU_V235/17_1MM  [V235/17_1MM]
R46  47  R-EU_V235/17_1MM  [V235/17_1MM]
R47  2702  SMD-RES-4.7K-5%-1/8W(0805)  [R0805]
R48  2201  SMD-RES-2.2K-5%-1/8W(0805)  [R0805]
R49  1002  SMD-RES-4.7K-5%-1/8W(0805)  [R0805]
R50  1002  SMD-RES-10K-1%-1/8W(0805)  [R0805]
R51  102  SMD-RES-1K-5%-1/8W(0805)  [R0805]
R52  2702  SMD-RES-4.7K-5%-1/8W(0805)  [R0805]
R53  1002  SMD-RES-1K-5%-1/8W(0805)  [R0805]
R54  1002  SMD-RES-1K-5%-1/8W(0805)  [R0805]
R55  R_user  R-EU_R0805  [R0805]
R56  104  SMD-RES-10K-1%-1/8W(0805)  [R0805]
R57  104  SMD-RES-10K-1%-1/8W(0805)  [R0805]
R58  104  SMD-RES-10K-1%-1/8W(0805)  [R0805]
R59  13  SMD-RES-13R-5%-1/4W(1206)  [R1206]
R60  2201  SMD-RES-1K-5%-1/8W(0805)  [R0805]
R61  100  SMD-RES-220R-5%-1/8W(0805)  [R0805]
R62  13  SMD-RES-13R-5%-1/4W(1206)  [R1206]
R63  4701  SMD-RES-4.7K-5%-1/8W(0805)  [R0805]
R64  104  SMD-RES-4.7K-5%-1/8W(0805)  [R0805]
R65  100  SMD-RES-2.2K-5%-1/8W(0805)  [R0805]
R66  100  SMD-RES-2.2K-5%-1/8W(0805)  [R0805]
SJ1  SJ  [SJ]
SJ3  SJ  [SJ]
START1  TPSB2.0  [B2.0]
TP14  TPSB2.0  [B2.0]
TP15  TPSB2.0  [B2.0]
TP20  TPSB2.0  [B2.0]
TP27  TPSB2.0  [B2.0]
TP28  TPSB2.0  [B2.0]
TP29  TPSB2.0  [B2.0]
TP30  TPSB2.0  [B2.0]
TP31  TPSB2.0  [B2.0]
TP32  TPSB2.0  [B2.0]
TP33  TPSB2.0  [B2.0]
TP34  TPSB2.0  [B2.0]
TP35  TPSB2.0  [B2.0]
TP36  TPSB2.0  [B2.0]
TP37  TPSB2.0  [B2.0]
TP38  TPSB2.0  [B2.0]
TP39  TPSB2.0  [B2.0]
TP40  TPSB2.0  [B2.0]
TP41  TPSB2.0  [B2.0]
TP42  TPSB1,27  [B1,27]
TP43  TPSB2.0  [B2.0]
TP44  TPSB2.0  [B2.0]
TP45  TPSB2.0  [B2.0]
TP46  TPSB2.0  [B2.0]
X1  CON_BMWV2  [24-PIN_V2]
X2  22-23-2051  [22-23-2051]
X3  22-23-2021  [22-23-2021]

### Nets
+10V: 10V1.TP(PP) C9.1 IC6.4(R) IC6.8(V+) IC7.3(A:CD) IC7.5(A:B) IC7.13(B:CD) IC7.16(P:VDD) IC8.1(OUT) R47.2 R64.2 ; also sheet 2,4,5,6,7
+12V: 4.1 C13.1 D13.C IC1.16(VDD) IC3.9(CD+) IC5.3(IN) IC8.3(IN) JP1.2 R15.2 R16.2 R17.2 R36.1 R37.1 R41.1 R65.2 R66.2 TP45.TP(PP) X2.1 ; also sheet 2,4,5,6,7
+12V2: 4.11 Q8.2(C) R48.1 TP44.TP(PP)
GND: 3.12 C1.2 C3.2 C4.2 C5.2 C6.2 C7.1 C8.1 C9.2 C10.2 C11.2 C12.1 C13.2 D11.1(+) D13.A D14.A D17.A IC1.8(VSS) IC1.11(D) IC3.8(GND) IC4.12(P:GND) IC5.2(GND) IC5.2@1(GND) IC6.1(GND) IC7.1(A:T1) IC7.8(P:VSS) IC7.15(B:T1) IC8.2(GND) IC8.2@1(GND) IC9.4(P:V-) Q9.2(S) Q11.2(S) Q13.2(S) R19.1 R25.1 R29.1 R30.2 R31.2 R33.2 R42.2 R45.1 R46.1 R54.1 R55.2 R59.2 R60.2 R61.1 X1.13 X1.18 X1.23 X2.5 X3.1 ; also sheet 2,4,5,6,7
N$168: R7.2 R14.1
N$169: 4.9 D7.1(+) D8.1(+) JP3.1 JP4.2 TP42.TP(PP)
N$170: IC1.10(A) R17.1 R58.1 R58.2 X1.4 X2.2
N$171: IC1.13(B) R16.1 R57.1 R57.2 X1.3 X2.3
N$172: D11.2(-) Q4.2(C) START1.TP(PP) X1.5
N$173: IC1.12(C) R15.1 R56.1 R56.2 X1.2 X2.4
N$174: 4.7 LED5.A TP40.TP(PP) X1.8
N$175: 4.2 D9.2(-) LED1.K(C) TP35.TP(PP) X1.12
N$176: 4.3 D8.2(-) LED2.K(C) TP36.TP(PP) X1.11
N$177: 4.4 D7.2(-) LED3.K(C) TP37.TP(PP) X1.10
N$178: 4.8 D10.2(-) LED6.K(C) TP41.TP(PP) X1.14
N$179: 3.9 D3.1(+) TP32.TP(PP) X1.17
N$180: 3.11 D5.1(+) TP34.TP(PP) X1.19
N$181: D14.C R18.2 X1.22
N$182: C5.1 IC9.3(A:+IN) R18.1
N$183: IC4.1(B:OUT) R22.2 R27.2
N$184: C1.1 R22.1 R23.2
N$185: C3.1 IC4.4(A:-IN) IC4.10(D:-IN) R23.1
N$186: IC4.5(A:+IN) IC4.11(D:+IN) R24.1 R25.2 R26.2
N$187: C6.1 IC4.9(C:+IN) R29.2 R38.2
N$188: C7.2 IC4.14(C:OUT) R28.2
N$189: Q7.1(B) R28.1
N$190: IC1.2(Q2) IC3.7(I7)
N$196: 3.5 IC3.12(O5) TP28.TP(PP)
N$197: IC1.1(Q4) IC3.4(I4)
N$198: 4.10 TP43.TP(PP) X1.15
N$199: 4.5 D6.2(-) LED4.K(C) TP38.TP(PP) X1.9
N$200: D6.1(+) R7.1
N$201: IC1.6(Q5) IC3.3(I3)
N$202: 3.4 IC3.10(O7) TP27.TP(PP)
N$203: IC2.1(ADJ) R11.1 R20.2 X1.7
N$204: IC4.6(B:-IN) IC4.8(C:-IN) R20.1
N$205: 3.2 Q6.2(C) TP15.TP(PP)
N$206: 3.1 D16.2(-) TP14.TP(PP)
N$281: R44.2 X1.16
N$282: IC1.15(Q3) IC3.5(I5)
N$283: 3.6 IC3.13(O4) TP29.TP(PP)
N$284: 3.7 IC3.14(O3) TP30.TP(PP)
N$285: 4.6 JP2.2 TP39.TP(PP)
N$286: LED5.K(C) R33.1
N$287: LED1.A LED2.A LED3.A LED4.A LED6.A R34.1
N$288: Q4.1(B) R35.2
N$289: IC1.3(Q0) IC3.1(I1) IC3.2(I2) Q10.1(G) Q11.1(G)
N$295: IC1.14(Q1) IC3.6(I6)
N$296: 3.3 IC3.11(O6) TP20.TP(PP)
N$297: Q5.1(B) Q5.2(C) Q6.1(B) R30.1 R31.1 R55.1 X3.2
N$298: Q6.3(E) R37.2
N$299: Q5.3(E) R36.2
N$300: IC4.7(B:+IN) R21.1 R38.1
N$301: IC9.2(A:-IN) R19.2
N$302: Q8.1(B) R39.2 R60.1
N$303: Q9.3(D) R40.2
N$304: IC2.2(VO) R11.2
N$305: IC2.3(VI) Q7.2(C)
N$306: IC6.5(CV) R43.2
N$307: IC6.3(Q) IC7.4(A:A) IC7.12(B:A) R43.1
N$308: D12.1(+) R44.1
N$309: 3.10 D3.2(-) D5.2(-) JP5.1 SJ1.1 TP33.TP(PP)
N$310: JP5.2 R45.2 R46.2 SJ1.2
N$311: IC7.9(B:!Q) IC7.11(B:B) R49.2
N$312: C10.1 IC7.14(B:T2) R47.1
N$313: JP1.1 R48.2
N$314: IC3.15(O2) R35.1
N$315: 4.12 R49.1 TP46.TP(PP)
N$316: D9.1(+) JP3.2
N$317: IC9.1(A:OUT) R50.2
N$318: C11.1 R50.1 R51.1
N$319: IC9.5(B:+IN) Q11.3(D) R51.2 R52.2
N$320: IC9.6(B:-IN) R53.1 R54.2
N$321: D10.1(+) JP4.1
N$322: JP2.3 R40.1
N$323: IC4.13(D:OUT) JP2.1 Q9.1(G) R41.2
N$324: R32.1 X1.21
N$325: IC3.16(O1) Q10.3(D) R62.1
N$326: D15.2(-) R65.1 R66.1
N$327: 3.8 R62.2 TP31.TP(PP)
N$328: Q10.2(S) R61.2
N$329: D16.1(+) X1.1
N$330: Q8.3(E) R59.1
N$331: C8.2 D12.2(-) D17.C IC6.2(TR) IC6.6(THR) R42.1
N$332: Q12.1(B) R63.1
N$333: Q13.3(D) R63.2
N$334: Q12.2(C) R14.2 SJ3.2
N$335: IC9.7(B:OUT) R32.2 R39.1 R52.1
N$336: IC4.2(A:OUT) R26.1
N$337: IC7.7(A:!Q) Q13.1(G)
N$338: C12.2 IC7.2(A:T2) R64.1
V+: D15.1(+) Q4.3(E) Q7.3(E) Q12.3(E) SJ3.1 X1.6 ; also sheet 2,4,5,6,7
VCC: 6V1.TP(PP) C4.1 IC4.3(P:V+) IC5.1(OUT) IC9.8(P:V+) R21.2 R24.2 R27.1 R34.2 R53.2 ; also sheet 2,4,5,6,7
Unconnected: IC1.4(Q7) IC1.5(Q9) IC1.7(Q6) IC1.9(Q8) IC6.7(DIS) IC7.6(A:Q) IC7.10(B:Q) X1.20 X1.24

### Notes on the sheet
- Externe Beschaltung
- Variante "eine LED leuchtet"
- Variante "alle LEDs bis und
   mit Gang X leuchten"
- Anzeige:
- Klemmleisten
  Ausgang:
- Gang 1
- DauerPlus
  Konstant-Strom für LEDs
  Gang 1
  Gang 2
  Gang 3
  Gang 4
  Gang 5
  Neutrallampe
  Blinker rechts
  Blinker zusammen
  Blinker links
  Masse
- Gang 1
- Gang 2
- Gang 2
- Gang 3
- Gang 3
- Gang 1 | Gang 2 | Gang 3 | Gang 4 | Gang 5
- Gang 4
- Gang 4 | Klemmleisten Ausgang:
- Gang 5
- Gang 5
- Zündugsplus
  Choke
  Öldrucklampe
  Temperaturlampe
  Ladekontrolllampe
  Tankgeber (100hm)
  ABS-Lampe
  Lampentest
  Warnlampe
  Fernlichtlampe
  Geschwindigkeitssignal
  Menütaster
- Stromquelle für Gang
  LEDs. Für mehr als 12mA
  muss ein Widerstand "R_user"
  eingelötet werden. Für weniger
  muss der 1kOhm SMD Widerstand
  neben R_user entfernt werden
  I = 12V/1kOhm(default)+12V/R_user
  I= 12mA (default) + 12V/R_user
  Beispiel:
  R_user      Strom in LEDs
  1 kOhm     22-26mA
  ohne       11-13mA
- Externe Beschaltung
- an Zündungsplus anhängen
  (Neutral leuchtet wenn Gang 0
  eingelegt und Zündschlüssel steckt )
- Neutrallampe
  für eigene
  Ganganzeige
- DauerPlus Batterie 12V (rot weiss)
  Ganganzeige Signal C (gelb weiss)
  Ganganzeige Signal B (gelb schwarz)
  Ganganzeige Signal A (gelb dunkelblau)
  12V/350mA zum Starknopf (schwarz grün)
  Zündungsplus 12V (grün schwarz)
  Reservelampe (weiss)
  ABS Leuchte (blau)
  Ladekontrollleuchte (schaltet auf Masse) (violett schwarz)
  Temperaturleuchte (schaltet auf Masse) (braun schwarz)
  Öldruckleuchte (schaltet auf Masse) (braun grün)
  Chokelampe (schaltet auf Masse) (violett weiss)
- BL resistors
- 1k
- an Ausgang "Neutrallampe" anhängen
- Masse (braun)
  Lampentest (schaltet auf Masse)(weiss blau)
  Fernlichtlampe (12V) (weiss)
  Drehzahl Zündspule (schwarz blau)
  Blinker rechts (blau scharz)
  Masse (braun)
  Blinker links (blau rot)
  nicht angeschlossen
  Tachosiganl zum Blinrelais (balu grün)
  Tachogeber (gelb)
  Masse Tachobeger (braun)
  Tachobeleuchtung (12V Zündungsplus) (grau blau)
- RES | BAR
- 4.7V | rising edge trigger A
- non retriggerable
- ZündungsPlus
- current source 96mA
- 6V regulated for Opamps
- nicht bestückt
- retriggerable
- Standard panel Fiducial | panel Fiducial with solder mask around fiducial

## Sheet 4 of 7
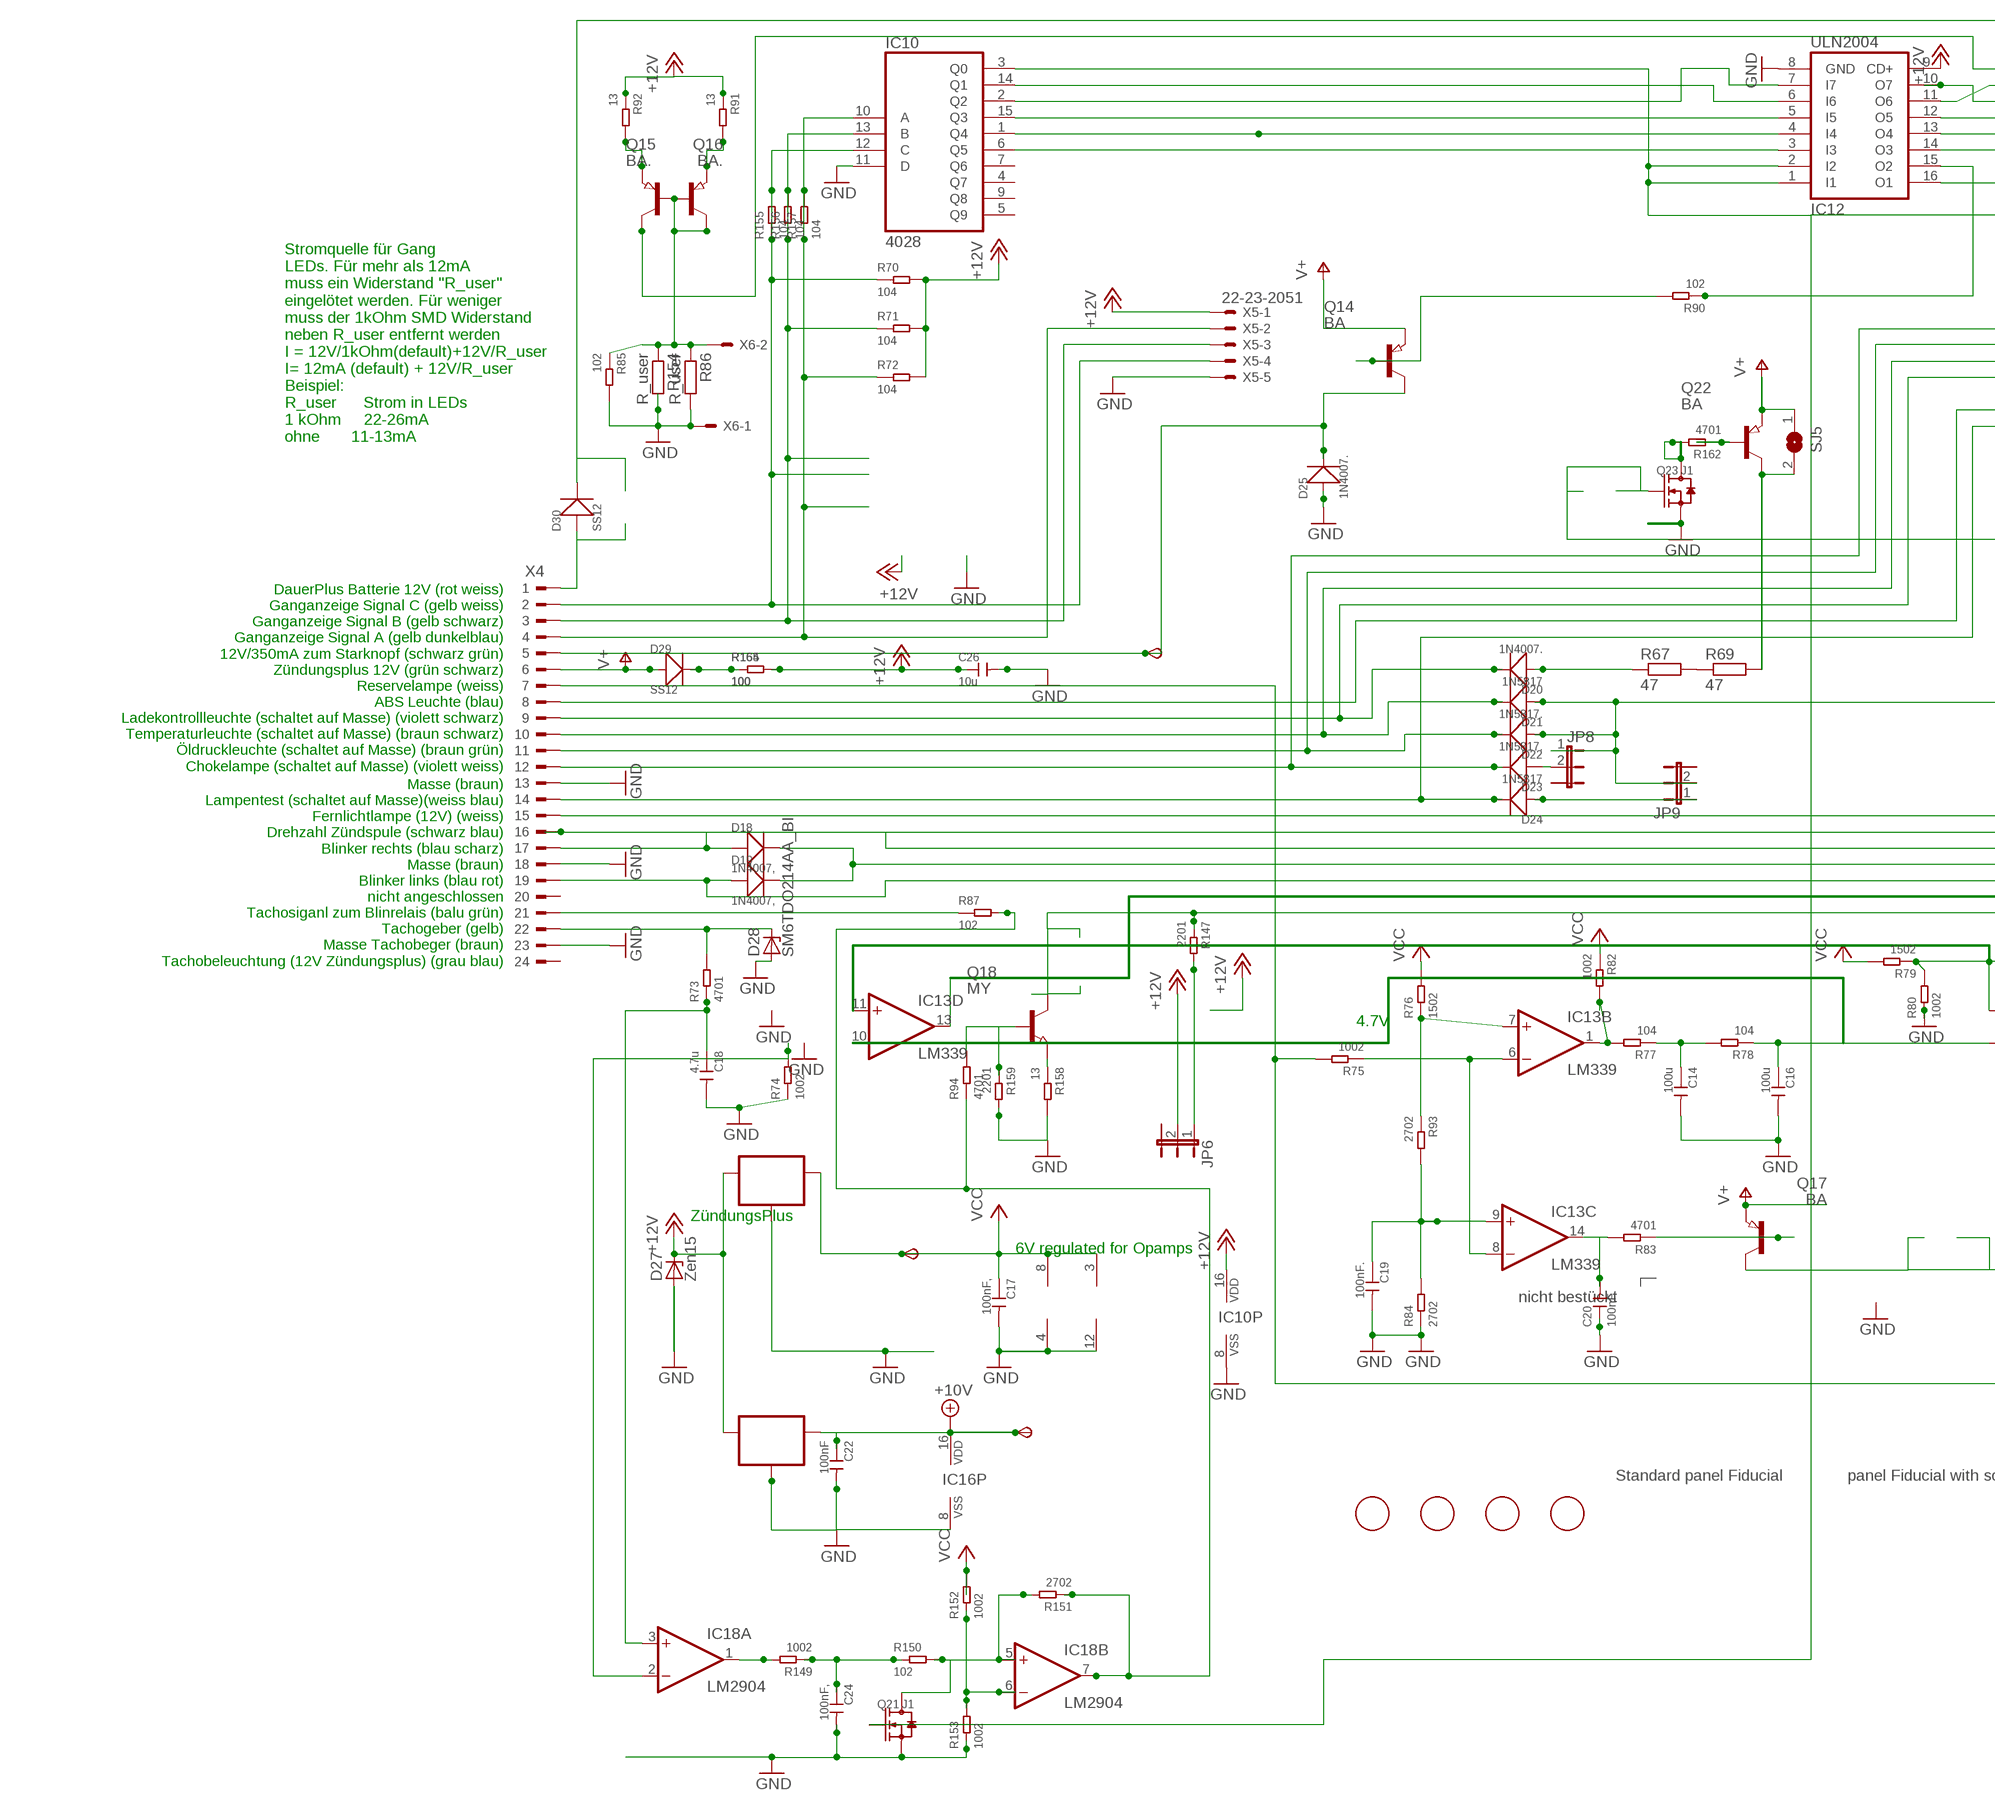
[diagram p5: schematic, sheet 4, part 1 of 2]
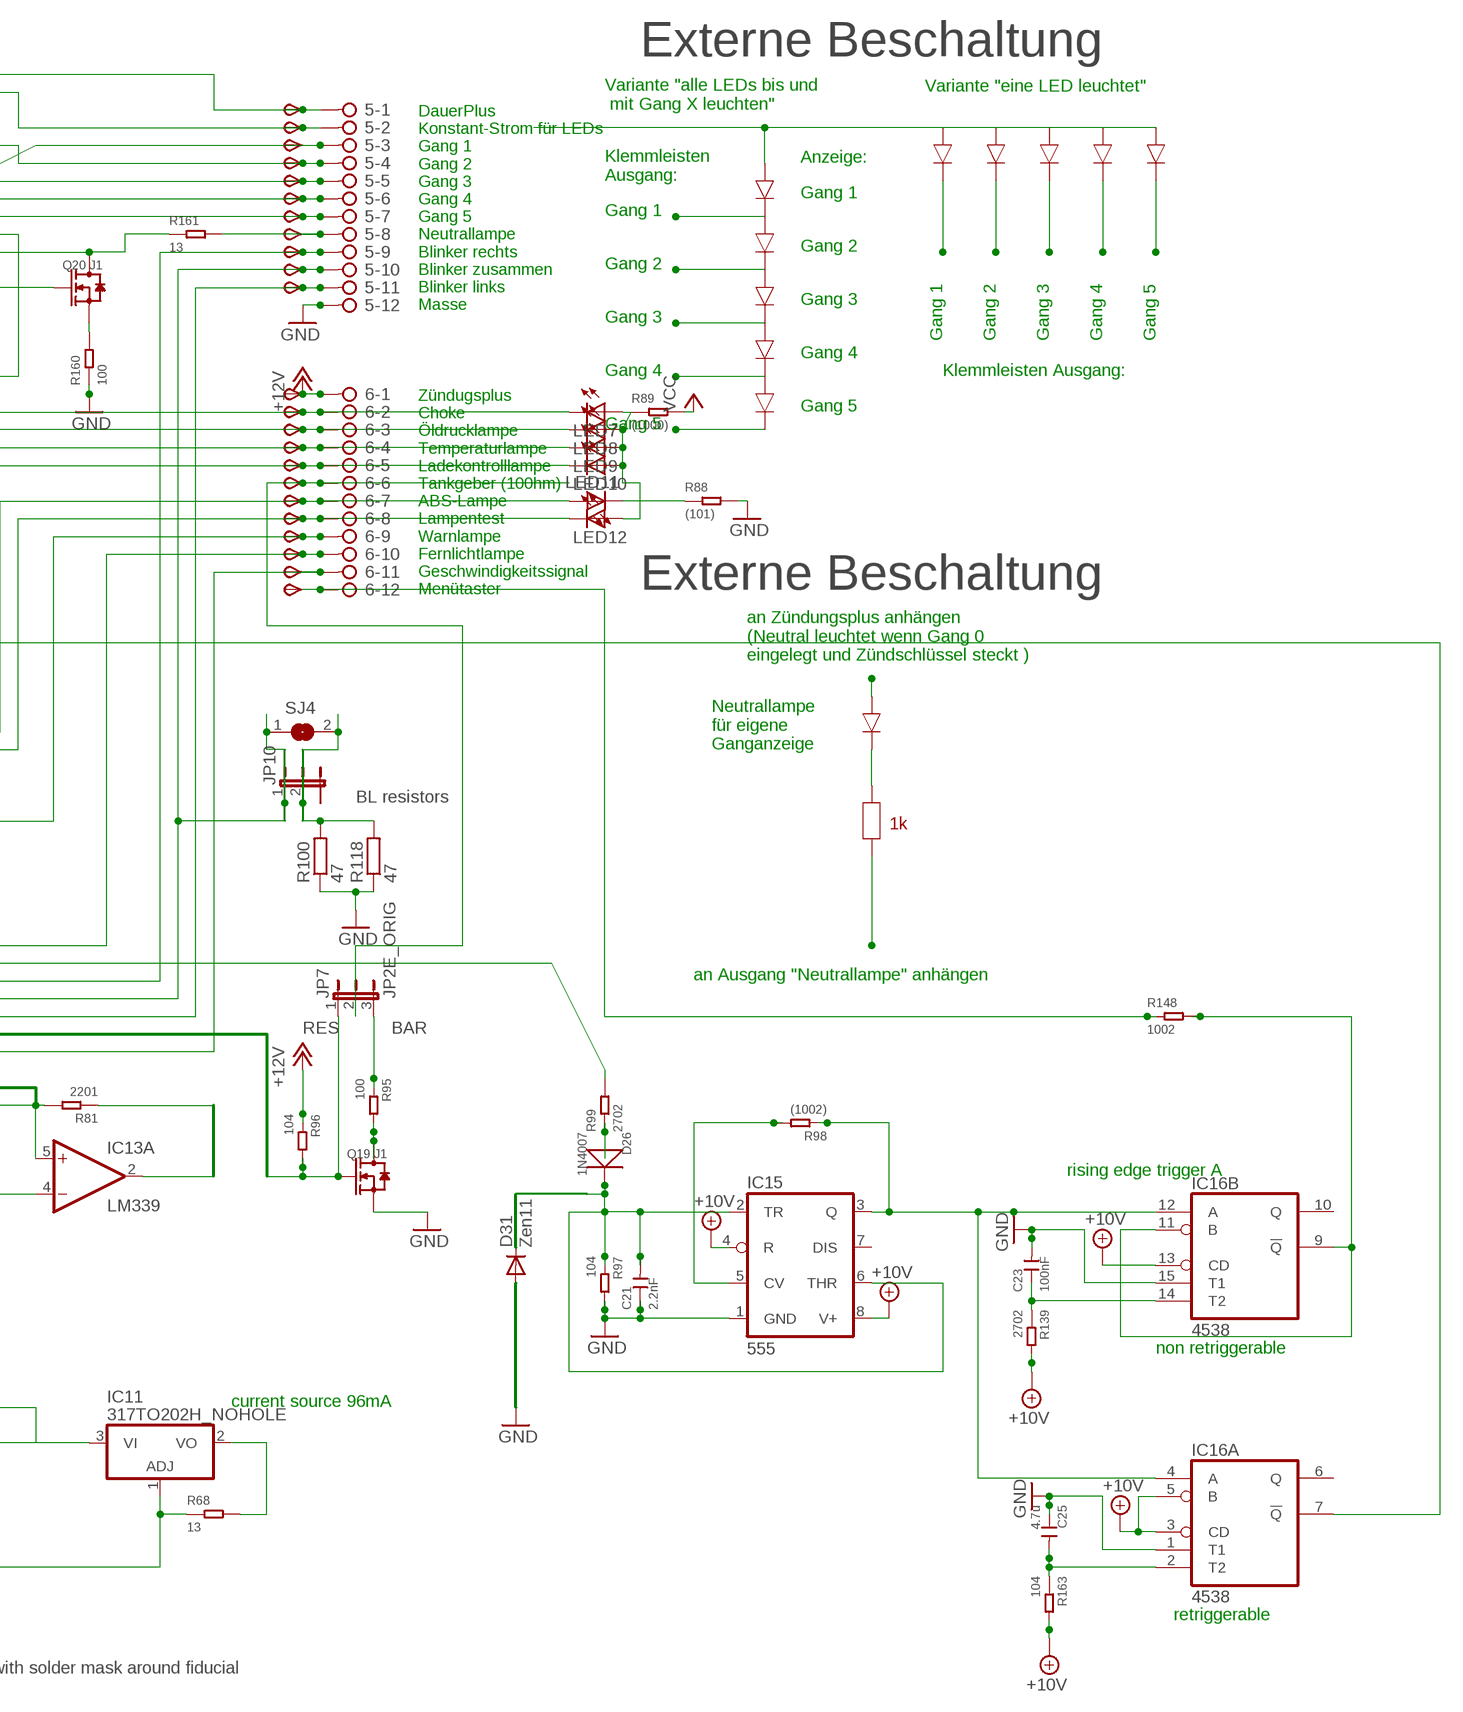
[diagram p6: schematic, sheet 4, part 2 of 2]

### Parts
5  2081-1132  [12-PIN]
6  2081-1132  [12-PIN]
6V2  TPSB2.0  [B2.0]
10V2  TPSB2.0  [B2.0]
C14  100u  CERAMIC-100UF-6.3V-20%-X5R(1206)  [C1206]
C16  100u  CERAMIC-100UF-6.3V-20%-X5R(1206)  [C1206]
C17  100nF,  CERAMIC-100NF-50V-10%-X7R(0805)  [C0805]
C18  4.7u  CERAMIC-4.7UF-25V-10%-X5R(0805)  [C0805]
C19  100nF.  CERAMIC-100NF-50V-10%-X7R(0805)  [C0805]
C20  100nF.  CERAMIC-100NF-50V-10%-X7R(0805)  [C0805]
C21  2.2nF  CERAMIC-100NF-50V-10%-X7R(0805)  [C0805]
C22  100nF  CERAMIC-100NF-50V-10%-X7R(0805)  [C0805]
C23  100nF  CERAMIC-100NF-50V-10%-X7R(0805)  [C0805]
C24  100nF,  CERAMIC-100NF-50V-10%-X7R(0805)  [C0805]
C25  4.7u  CERAMIC-4.7UF-25V-10%-X5R(0805)  [C0805]
C26  10u  CERAMIC-100UF-6.3V-20%-X5R(1206)  [C1206]
D18  1N4007,  DIODE-GEN-PURPOSE-1KV-1A(DO-214AC)  [DO-214AC]
D19  1N4007,  DIODE-GEN-PURPOSE-1KV-1A(DO-214AC)  [DO-214AC]
D20  1N4007.  DIODE-GEN-PURPOSE-1KV-1A(DO-214AC)  [DO-214AC]
D21  1N5817  DIODE-GEN-PURPOSE-1KV-1A(DO-214AC)DO-214AC/1206  [DO-214AC_SLIM]
D22  1N5817.  DIODE-GEN-PURPOSE-1KV-1A(DO-214AC)DO-214AC/1206  [DO-214AC_SLIM]
D23  1N5817.  DIODE-GEN-PURPOSE-1KV-1A(DO-214AC)DO-214AC/1206  [DO-214AC_SLIM]
D24  1N5817  DIODE-GEN-PURPOSE-1KV-1A(DO-214AC)DO-214AC/1206  [DO-214AC_SLIM]
D25  1N4007.  DIODE-GEN-PURPOSE-1KV-1A(DO-214AC)  [DO-214AC]
D26  1N4007  DIODE-GEN-PURPOSE-1KV-1A(DO-214AC)  [DO-214AC]
D27  Zen15  SM6T  [DO214AA]
D28  SM6TDO214AA_BI  [DO214AA_BI]
D29  SS12  DIODE-GEN-PURPOSE-1KV-1A(DO-214AC)DO-214AC/1206  [DO-214AC_SLIM]
D30  SS12  DIODE-GEN-PURPOSE-1KV-1A(DO-214AC)DO-214AC/1206  [DO-214AC_SLIM]
D31  Zen11  CGRM4001-G  [SOD-123_MINI-SMA]
FID7  FIDUCIAL  [FIDUCIAL_1MM]
FID8  FIDUCIAL  [FIDUCIAL_1MM]
FID9  FIDUCIAL  [FIDUCIAL_1MM]
FID10  FIDUCIAL  [FIDUCIAL_1MM]
IC10  4028  4028D  [SO16]
IC11  317TO202H_NOHOLE  [TO220H_NOHOLE]
IC12  ULN2004  ULN2004AD  [SO16]
IC13  LM339  LM339D  [SO14]
IC14  78L06  78LXXSOT89_ROUND  [SOT89_ROUND]
IC15  555  NE555D  [SO08]
IC16  4538  4538D  [SO16]
IC17  78L10  78LXXSOT89_ROUND  [SOT89_ROUND]
IC18  LM2904  LM358D  [SO08]
JP6  JP2EJP2_SMALLPADS  [JP2_SMALLPADS]
JP7  JP2E_ORIG  [JP2_ORIG_SMALLPADS]
JP8  JP2EJP2_SMALLPADS  [JP2_SMALLPADS]
JP9  JP2EJP2_SMALLPADS  [JP2_SMALLPADS]
JP10  JP2EJP2_SMALLPADS  [JP2_SMALLPADS]
LED7  LEDLD260  [LD260]
LED8  LEDLD260  [LD260]
LED9  LEDLD260  [LD260]
LED10  LEDLD260  [LD260]
LED11  LEDLD260  [LD260]
LED12  LEDLD260  [LD260]
Q14  BA  PNP-TRANSISTOR_SOT89  [SOT89]
Q15  BA.  PNP-TRANSISTOR_SOT89  [SOT89]
Q16  BA.  PNP-TRANSISTOR_SOT89  [SOT89]
Q17  BA  PNP-TRANSISTOR_SOT89  [SOT89]
Q18  MY  NPN-TRANSISTOR_SOT89  [SOT89]
Q19  J1  SMD-MOSFET-N-CH-50V-200MA-BSS138W-7-F(SOT-23)  [SOT-23]
Q20  J1  SMD-MOSFET-N-CH-50V-200MA-BSS138W-7-F(SOT-23)  [SOT-23]
Q21  J1  SMD-MOSFET-N-CH-50V-200MA-BSS138W-7-F(SOT-23)  [SOT-23]
Q22  BA  PNP-TRANSISTOR_SOT89  [SOT89]
Q23  J1  SMD-MOSFET-N-CH-50V-200MA-BSS138W-7-F(SOT-23)  [SOT-23]
R67  47  R-EU_V235/17_1MM  [V235/17_1MM]
R68  13  SMD-RES-13R-5%-1/4W(1206)  [R1206]
R69  47  R-EU_V235/17_1MM  [V235/17_1MM]
R70  104  SMD-RES-10K-1%-1/8W(0805)  [R0805]
R71  104  SMD-RES-10K-1%-1/8W(0805)  [R0805]
R72  104  SMD-RES-10K-1%-1/8W(0805)  [R0805]
R73  4701  SMD-RES-4.7K-5%-1/8W(0805)  [R0805]
R74  1002  SMD-RES-10K-1%-1/8W(0805)  [R0805]
R75  1002  SMD-RES-10K-1%-1/8W(0805)  [R0805]
R76  1502  SMD-RES-10K-1%-1/8W(0805)  [R0805]
R77  104  SMD-RES-10K-1%-1/8W(0805)  [R0805]
R78  104  SMD-RES-10K-1%-1/8W(0805)  [R0805]
R79  1502  SMD-RES-10K-1%-1/8W(0805)  [R0805]
R80  1002  SMD-RES-10K-1%-1/8W(0805)  [R0805]
R81  2201  SMD-RES-2.2K-5%-1/8W(0805)  [R0805]
R82  1002  SMD-RES-10K-1%-1/8W(0805)  [R0805]
R83  4701  SMD-RES-4.7K-5%-1/8W(0805)  [R0805]
R84  2702  SMD-RES-4.7K-5%-1/8W(0805)  [R0805]
R85  102  SMD-RES-1K-5%-1/8W(0805)  [R0805]
R86  R_user  R-EU_R0805  [R0805]
R87  102  SMD-RES-220R-5%-1/8W(0805)  [R0805]
R88  (101)  SMD-RES-100R-5%-1/8W(0805)  [R0805]
R89  (1000)  SMD-RES-100R-5%-1/8W(0805)  [R0805]
R90  102  SMD-RES-1K-5%-1/8W(0805)  [R0805]
R91  13  SMD-RES-13R-5%-1/4W(1206)  [R1206]
R92  13  SMD-RES-13R-5%-1/4W(1206)  [R1206]
R93  2702  SMD-RES-4.7K-5%-1/8W(0805)  [R0805]
R94  4701  SMD-RES-4.7K-5%-1/8W(0805)  [R0805]
R95  100  SMD-RES-2.2K-5%-1/8W(0805)  [R0805]
R96  104  SMD-RES-10K-1%-1/8W(0805)  [R0805]
R97  104  SMD-RES-10K-1%-1/8W(0805)  [R0805]
R98  (1002)  SMD-RES-10K-1%-1/8W(0805)  [R0805]
R99  2702  SMD-RES-10K-1%-1/8W(0805)  [R0805]
R100  47  R-EU_V235/17_1MM  [V235/17_1MM]
R118  47  R-EU_V235/17_1MM  [V235/17_1MM]
R139  2702  SMD-RES-4.7K-5%-1/8W(0805)  [R0805]
R147  2201  SMD-RES-2.2K-5%-1/8W(0805)  [R0805]
R148  1002  SMD-RES-4.7K-5%-1/8W(0805)  [R0805]
R149  1002  SMD-RES-10K-1%-1/8W(0805)  [R0805]
R150  102  SMD-RES-1K-5%-1/8W(0805)  [R0805]
R151  2702  SMD-RES-4.7K-5%-1/8W(0805)  [R0805]
R152  1002  SMD-RES-1K-5%-1/8W(0805)  [R0805]
R153  1002  SMD-RES-1K-5%-1/8W(0805)  [R0805]
R154  R_user  R-EU_R0805  [R0805]
R155  104  SMD-RES-10K-1%-1/8W(0805)  [R0805]
R156  104  SMD-RES-10K-1%-1/8W(0805)  [R0805]
R157  104  SMD-RES-10K-1%-1/8W(0805)  [R0805]
R158  13  SMD-RES-13R-5%-1/4W(1206)  [R1206]
R159  2201  SMD-RES-1K-5%-1/8W(0805)  [R0805]
R160  100  SMD-RES-220R-5%-1/8W(0805)  [R0805]
R161  13  SMD-RES-13R-5%-1/4W(1206)  [R1206]
R162  4701  SMD-RES-4.7K-5%-1/8W(0805)  [R0805]
R163  104  SMD-RES-4.7K-5%-1/8W(0805)  [R0805]
R164  100  SMD-RES-2.2K-5%-1/8W(0805)  [R0805]
R165  100  SMD-RES-2.2K-5%-1/8W(0805)  [R0805]
SJ4  SJ  [SJ]
SJ5  SJ  [SJ]
START2  TPSB2.0  [B2.0]
TP47  TPSB2.0  [B2.0]
TP48  TPSB2.0  [B2.0]
TP49  TPSB2.0  [B2.0]
TP50  TPSB2.0  [B2.0]
TP51  TPSB2.0  [B2.0]
TP52  TPSB2.0  [B2.0]
TP53  TPSB2.0  [B2.0]
TP54  TPSB2.0  [B2.0]
TP55  TPSB2.0  [B2.0]
TP56  TPSB2.0  [B2.0]
TP57  TPSB2.0  [B2.0]
TP58  TPSB2.0  [B2.0]
TP59  TPSB2.0  [B2.0]
TP60  TPSB2.0  [B2.0]
TP61  TPSB2.0  [B2.0]
TP62  TPSB2.0  [B2.0]
TP63  TPSB2.0  [B2.0]
TP64  TPSB2.0  [B2.0]
TP65  TPSB1,27  [B1,27]
TP66  TPSB2.0  [B2.0]
TP67  TPSB2.0  [B2.0]
TP68  TPSB2.0  [B2.0]
TP69  TPSB2.0  [B2.0]
X4  CON_BMWV2  [24-PIN_V2]
X5  22-23-2051  [22-23-2051]
X6  22-23-2021  [22-23-2021]

### Nets
+10V: 10V2.TP(PP) C22.1 IC15.4(R) IC15.8(V+) IC16.3(A:CD) IC16.5(A:B) IC16.13(B:CD) IC16.16(P:VDD) IC17.1(OUT) R139.2 R163.2 ; also sheet 2,3,5,6,7
+12V: 6.1 C26.1 D27.C IC10.16(VDD) IC12.9(CD+) IC14.3(IN) IC17.3(IN) JP6.2 R70.2 R71.2 R72.2 R91.1 R92.1 R96.1 R164.2 R165.2 TP68.TP(PP) X5.1 ; also sheet 2,3,5,6,7
+12V3: 6.11 Q18.2(C) R147.1 TP67.TP(PP)
GND: 5.12 C14.2 C16.2 C17.2 C18.2 C19.2 C20.1 C21.1 C22.2 C23.2 C24.2 C25.1 C26.2 D25.1(+) D27.A D28.A D31.A IC10.8(VSS) IC10.11(D) IC12.8(GND) IC13.12(P:GND) IC14.2(GND) IC14.2@1(GND) IC15.1(GND) IC16.1(A:T1) IC16.8(P:VSS) IC16.15(B:T1) IC17.2(GND) IC17.2@1(GND) IC18.4(P:V-) Q19.2(S) Q21.2(S) Q23.2(S) R74.1 R80.1 R84.1 R85.2 R86.2 R88.2 R97.2 R100.1 R118.1 R153.1 R154.2 R158.2 R159.2 R160.1 X4.13 X4.18 X4.23 X5.5 X6.1 ; also sheet 2,3,5,6,7
N$462: R67.2 R69.1
N$463: 6.9 D21.1(+) D22.1(+) JP8.1 JP9.2 TP65.TP(PP)
N$464: IC10.10(A) R72.1 R157.1 R157.2 X4.4 X5.2
N$465: IC10.13(B) R71.1 R156.1 R156.2 X4.3 X5.3
N$466: D25.2(-) Q14.2(C) START2.TP(PP) X4.5
N$467: IC10.12(C) R70.1 R155.1 R155.2 X4.2 X5.4
N$468: 6.7 LED11.A TP63.TP(PP) X4.8
N$469: 6.2 D23.2(-) LED7.K(C) TP58.TP(PP) X4.12
N$470: 6.3 D22.2(-) LED8.K(C) TP59.TP(PP) X4.11
N$471: 6.4 D21.2(-) LED9.K(C) TP60.TP(PP) X4.10
N$472: 6.8 D24.2(-) LED12.K(C) TP64.TP(PP) X4.14
N$473: 5.9 D18.1(+) TP55.TP(PP) X4.17
N$474: 5.11 D19.1(+) TP57.TP(PP) X4.19
N$475: D28.C R73.2 X4.22
N$476: C18.1 IC18.3(A:+IN) R73.1
N$477: IC13.1(B:OUT) R77.2 R82.2
N$478: C14.1 R77.1 R78.2
N$479: C16.1 IC13.4(A:-IN) IC13.10(D:-IN) R78.1
N$480: IC13.5(A:+IN) IC13.11(D:+IN) R79.1 R80.2 R81.2
N$481: C19.1 IC13.9(C:+IN) R84.2 R93.2
N$482: C20.2 IC13.14(C:OUT) R83.2
N$483: Q17.1(B) R83.1
N$484: IC10.2(Q2) IC12.7(I7)
N$485: 5.5 IC12.12(O5) TP51.TP(PP)
N$486: IC10.1(Q4) IC12.4(I4)
N$487: 6.10 TP66.TP(PP) X4.15
N$488: 6.5 D20.2(-) LED10.K(C) TP61.TP(PP) X4.9
N$489: D20.1(+) R67.1
N$490: IC10.6(Q5) IC12.3(I3)
N$491: 5.4 IC12.10(O7) TP50.TP(PP)
N$492: IC11.1(ADJ) R68.1 R75.2 X4.7
N$493: IC13.6(B:-IN) IC13.8(C:-IN) R75.1
N$494: 5.2 Q16.2(C) TP48.TP(PP)
N$495: 5.1 D30.2(-) TP47.TP(PP)
N$509: R99.2 X4.16
N$510: IC10.15(Q3) IC12.5(I5)
N$511: 5.6 IC12.13(O4) TP52.TP(PP)
N$512: 5.7 IC12.14(O3) TP53.TP(PP)
N$513: 6.6 JP7.2 TP62.TP(PP)
N$514: LED11.K(C) R88.1
N$515: LED7.A LED8.A LED9.A LED10.A LED12.A R89.1
N$516: Q14.1(B) R90.2
N$517: IC10.3(Q0) IC12.1(I1) IC12.2(I2) Q20.1(G) Q21.1(G)
N$518: IC10.14(Q1) IC12.6(I6)
N$519: 5.3 IC12.11(O6) TP49.TP(PP)
N$520: Q15.1(B) Q15.2(C) Q16.1(B) R85.1 R86.1 R154.1 X6.2
N$521: Q16.3(E) R92.2
N$522: Q15.3(E) R91.2
N$523: IC13.7(B:+IN) R76.1 R93.1
N$524: IC18.2(A:-IN) R74.2
N$525: Q18.1(B) R94.2 R159.1
N$526: Q19.3(D) R95.2
N$527: IC11.2(VO) R68.2
N$528: IC11.3(VI) Q17.2(C)
N$529: IC15.5(CV) R98.2
N$530: IC15.3(Q) IC16.4(A:A) IC16.12(B:A) R98.1
N$531: D26.1(+) R99.1
N$532: 5.10 D18.2(-) D19.2(-) JP10.1 SJ4.1 TP56.TP(PP)
N$533: JP10.2 R100.2 R118.2 SJ4.2
N$534: IC16.9(B:!Q) IC16.11(B:B) R148.2
N$535: C23.1 IC16.14(B:T2) R139.1
N$536: JP6.1 R147.2
N$537: IC12.15(O2) R90.1
N$538: 6.12 R148.1 TP69.TP(PP)
N$539: D23.1(+) JP8.2
N$540: IC18.1(A:OUT) R149.2
N$541: C24.1 R149.1 R150.1
N$542: IC18.5(B:+IN) Q21.3(D) R150.2 R151.2
N$543: IC18.6(B:-IN) R152.1 R153.2
N$544: D24.1(+) JP9.1
N$545: JP7.3 R95.1
N$546: IC13.13(D:OUT) JP7.1 Q19.1(G) R96.2
N$547: R87.1 X4.21
N$548: IC12.16(O1) Q20.3(D) R161.1
N$549: D29.2(-) R164.1 R165.1
N$550: 5.8 R161.2 TP54.TP(PP)
N$551: Q20.2(S) R160.2
N$552: D30.1(+) X4.1
N$553: Q18.3(E) R158.1
N$554: C21.2 D26.2(-) D31.C IC15.2(TR) IC15.6(THR) R97.1
N$555: Q22.1(B) R162.1
N$556: Q23.3(D) R162.2
N$557: Q22.2(C) R69.2 SJ5.2
N$558: IC18.7(B:OUT) R87.2 R94.1 R151.1
N$559: IC13.2(A:OUT) R81.1
N$560: IC16.7(A:!Q) Q23.1(G)
N$561: C25.2 IC16.2(A:T2) R163.1
V+: D29.1(+) Q14.3(E) Q17.3(E) Q22.3(E) SJ5.1 X4.6 ; also sheet 2,3,5,6,7
VCC: 6V2.TP(PP) C17.1 IC13.3(P:V+) IC14.1(OUT) IC18.8(P:V+) R76.2 R79.2 R82.1 R89.2 R152.2 ; also sheet 2,3,5,6,7
Unconnected: IC10.4(Q7) IC10.5(Q9) IC10.7(Q6) IC10.9(Q8) IC15.7(DIS) IC16.6(A:Q) IC16.10(B:Q) X4.20 X4.24

### Notes on the sheet
- Externe Beschaltung
- Variante "eine LED leuchtet"
- Variante "alle LEDs bis und
   mit Gang X leuchten"
- Anzeige:
- Klemmleisten
  Ausgang:
- Gang 1
- DauerPlus
  Konstant-Strom für LEDs
  Gang 1
  Gang 2
  Gang 3
  Gang 4
  Gang 5
  Neutrallampe
  Blinker rechts
  Blinker zusammen
  Blinker links
  Masse
- Gang 1
- Gang 2
- Gang 2
- Gang 3
- Gang 3
- Gang 1 | Gang 2 | Gang 3 | Gang 4 | Gang 5
- Gang 4
- Gang 4 | Klemmleisten Ausgang:
- Gang 5
- Gang 5
- Zündugsplus
  Choke
  Öldrucklampe
  Temperaturlampe
  Ladekontrolllampe
  Tankgeber (100hm)
  ABS-Lampe
  Lampentest
  Warnlampe
  Fernlichtlampe
  Geschwindigkeitssignal
  Menütaster
- Stromquelle für Gang
  LEDs. Für mehr als 12mA
  muss ein Widerstand "R_user"
  eingelötet werden. Für weniger
  muss der 1kOhm SMD Widerstand
  neben R_user entfernt werden
  I = 12V/1kOhm(default)+12V/R_user
  I= 12mA (default) + 12V/R_user
  Beispiel:
  R_user      Strom in LEDs
  1 kOhm     22-26mA
  ohne       11-13mA
- Externe Beschaltung
- an Zündungsplus anhängen
  (Neutral leuchtet wenn Gang 0
  eingelegt und Zündschlüssel steckt )
- Neutrallampe
  für eigene
  Ganganzeige
- DauerPlus Batterie 12V (rot weiss)
  Ganganzeige Signal C (gelb weiss)
  Ganganzeige Signal B (gelb schwarz)
  Ganganzeige Signal A (gelb dunkelblau)
  12V/350mA zum Starknopf (schwarz grün)
  Zündungsplus 12V (grün schwarz)
  Reservelampe (weiss)
  ABS Leuchte (blau)
  Ladekontrollleuchte (schaltet auf Masse) (violett schwarz)
  Temperaturleuchte (schaltet auf Masse) (braun schwarz)
  Öldruckleuchte (schaltet auf Masse) (braun grün)
  Chokelampe (schaltet auf Masse) (violett weiss)
- BL resistors
- 1k
- an Ausgang "Neutrallampe" anhängen
- Masse (braun)
  Lampentest (schaltet auf Masse)(weiss blau)
  Fernlichtlampe (12V) (weiss)
  Drehzahl Zündspule (schwarz blau)
  Blinker rechts (blau scharz)
  Masse (braun)
  Blinker links (blau rot)
  nicht angeschlossen
  Tachosiganl zum Blinrelais (balu grün)
  Tachogeber (gelb)
  Masse Tachobeger (braun)
  Tachobeleuchtung (12V Zündungsplus) (grau blau)
- RES | BAR
- 4.7V | rising edge trigger A
- non retriggerable
- ZündungsPlus
- current source 96mA
- 6V regulated for Opamps
- nicht bestückt
- retriggerable
- Standard panel Fiducial | panel Fiducial with solder mask around fiducial